# EAGLE design oresat-c3-prototype (EAGLE 9.5.2)

## Sheet 1 of 4: Connectors
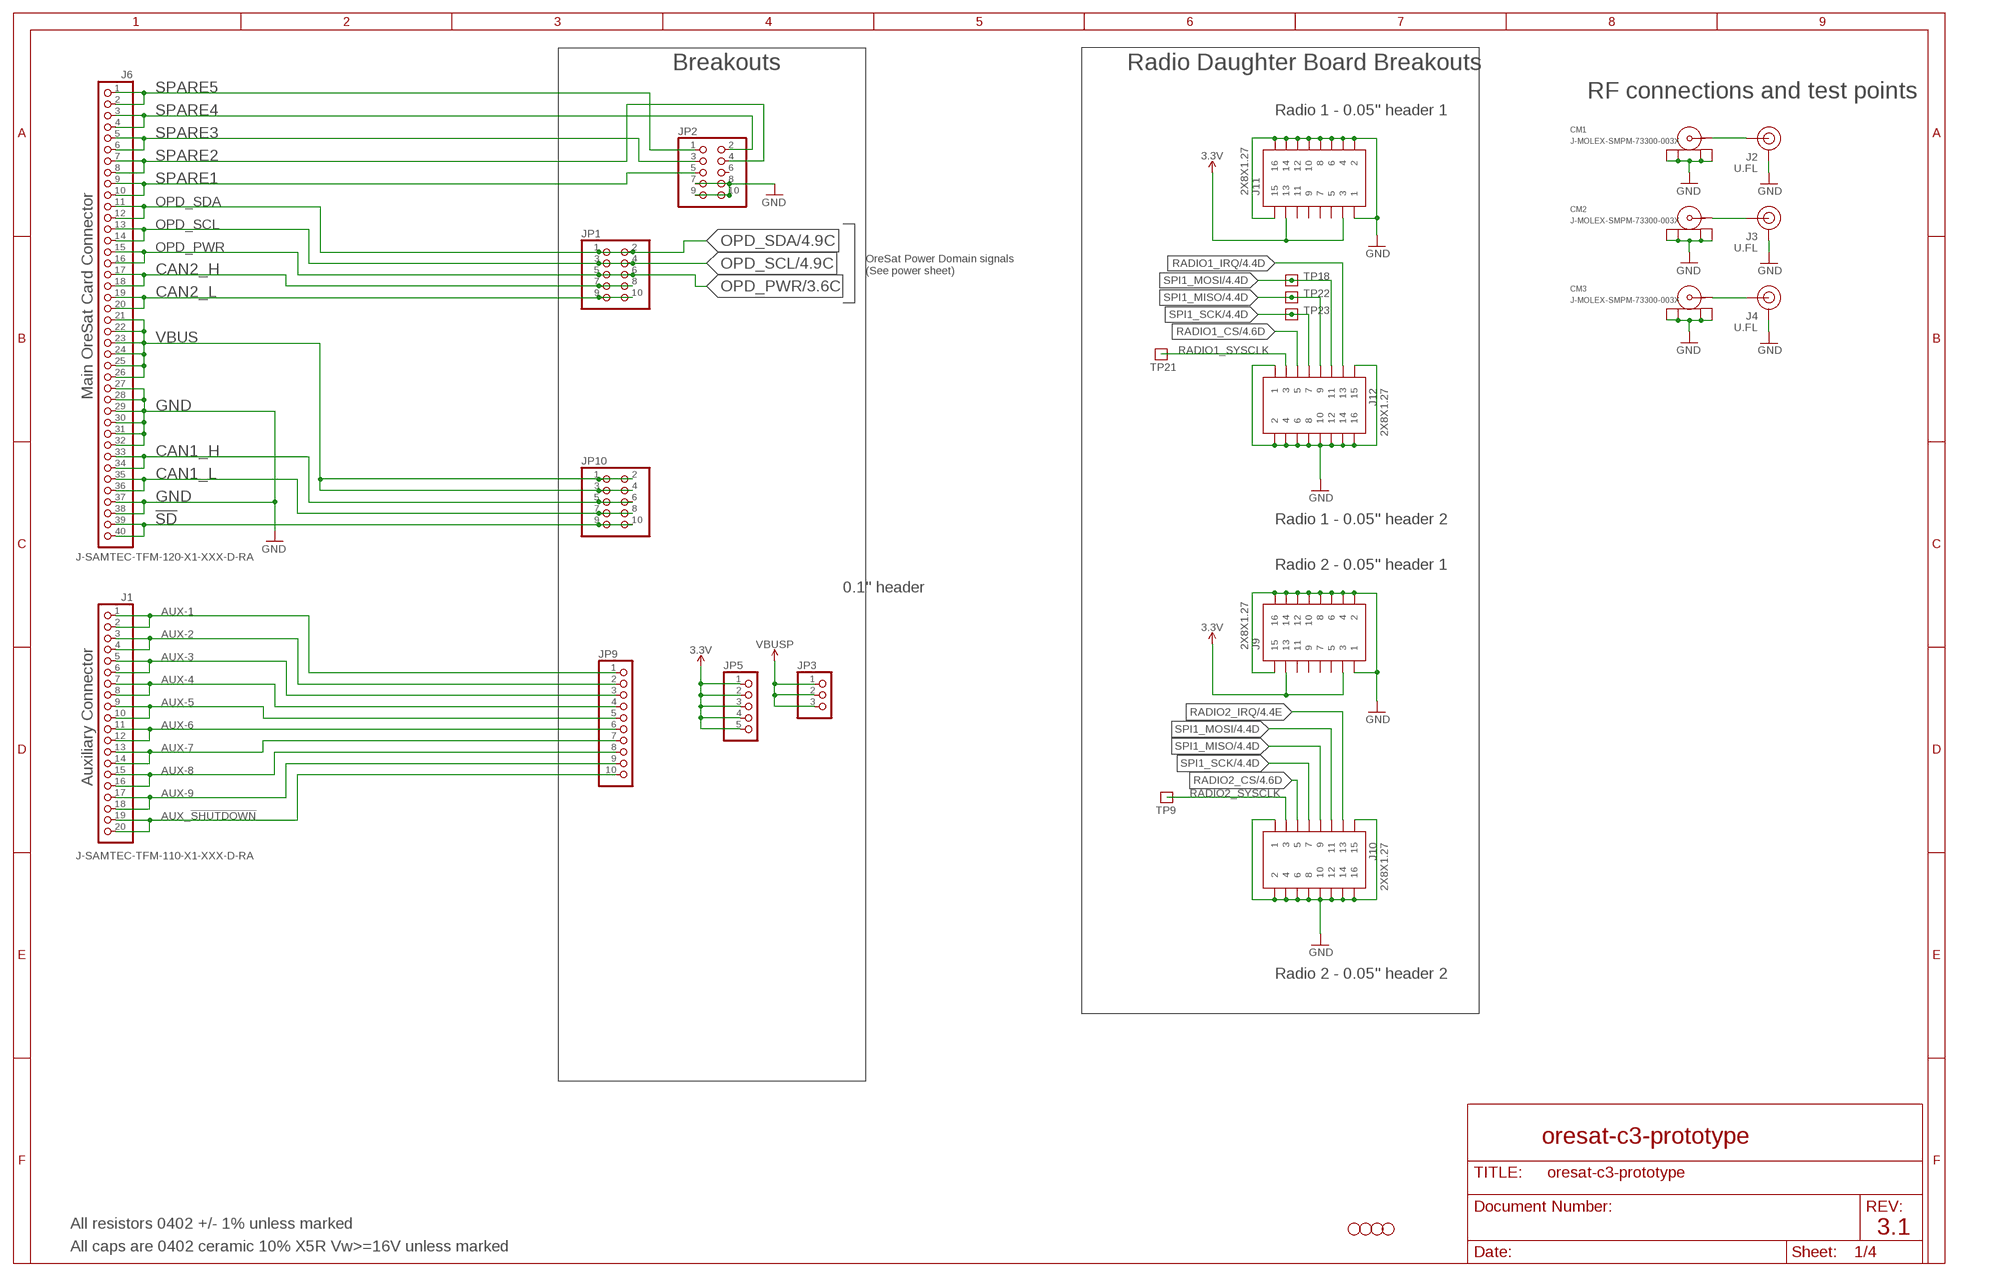
[diagram p0: schematic, sheet 1]

### Parts
CM1  J-MOLEX-SMPM-73300-003X  [J-MOLEX-SMPM-073300-003X]
CM2  J-MOLEX-SMPM-73300-003X  [J-MOLEX-SMPM-073300-003X]
CM3  J-MOLEX-SMPM-73300-003X  [J-MOLEX-SMPM-073300-003X]
H1  STAND-OFFTIGHT  [STAND-OFF-TIGHT]
H2  STAND-OFFTIGHT  [STAND-OFF-TIGHT]
H3  STAND-OFFTIGHT  [STAND-OFF-TIGHT]
H4  STAND-OFFTIGHT  [STAND-OFF-TIGHT]
J1  J-SAMTEC-TFM-110-X1-XXX-D-RA  [J-SAMTEC-TFM-110-X1-XXX-D-RA]
J2  U.FL  U.FL2PIN  [U.FL]
J3  U.FL  U.FL2PIN  [U.FL]
J4  U.FL  U.FL2PIN  [U.FL]
J6  J-SAMTEC-TFM-120-X1-XXX-D-RA  [J-SAMTEC-TFM-120-X1-XXX-D-RA]
J9  2X8X1.27  [2X8X1.27]
J10  2X8X1.27  [2X8X1.27]
J11  2X8X1.27  [2X8X1.27]
J12  2X8X1.27  [2X8X1.27]
JP1  PINHD-2X5  [2X05]
JP2  PINHD-2X5  [2X05]
JP3  PINHD-1X3  [1X03]
JP5  PINHD-1X5  [1X05]
JP9  PINHD-1X10  [1X10]
JP10  PINHD-2X5  [2X05]
TP9  TEST-POINT  [2MM-TEST-POINT]
TP18  TEST-POINT  [2MM-TEST-POINT]
TP21  TEST-POINT  [2MM-TEST-POINT]
TP22  TEST-POINT  [2MM-TEST-POINT]
TP23  TEST-POINT  [2MM-TEST-POINT]

### Nets
3.3V: J9.3 J9.13 J11.3 J11.13 JP5.1 JP5.2 JP5.3 JP5.4 JP5.5 ; also sheet 2,3,4
!SD: J6.39 J6.40 JP10.9 JP10.10 ; also sheet 4
AUX-1: J1.1 J1.2 JP9.1
AUX-2: J1.3 J1.4 JP9.2
AUX-3: J1.5 J1.6 JP9.3
AUX-4: J1.7 J1.8 JP9.4
AUX-5: J1.9 J1.10 JP9.5
AUX-6: J1.11 J1.12 JP9.6
AUX-7: J1.13 J1.14 JP9.7
AUX-8: J1.15 J1.16 JP9.8
AUX-9: J1.17 J1.18 JP9.9
AUX_!SHUTDOWN: J1.19 J1.20 JP9.10
CAN1_H: J6.33 J6.34 JP10.5 JP10.6 ; also sheet 4
CAN1_L: J6.35 J6.36 JP10.7 JP10.8 ; also sheet 4
CAN2_H: J6.17 J6.18 JP1.7 JP1.8 ; also sheet 4
CAN2_L: J6.19 J6.20 JP1.9 JP1.10 ; also sheet 4
GND: CM1.P$1(SHIELD3) CM1.P$2(SHIELD2) CM1.P$3(SHIELD1) CM1.P$4(SHIELD) CM2.P$1(SHIELD3) CM2.P$2(SHIELD2) CM2.P$3(SHIELD1) CM2.P$4(SHIELD) CM3.P$1(SHIELD3) CM3.P$2(SHIELD2) CM3.P$3(SHIELD1) CM3.P$4(SHIELD) J2.1(GND) J2.2(GND) J3.1(GND) J3.2(GND) J4.1(GND) J4.2(GND) J6.27 J6.28 J6.29 J6.30 J6.31 J6.32 J6.37 J6.38 J9.1 J9.2 J9.4 J9.6 J9.8 J9.10 J9.12 J9.14 J9.15 J9.16 J10.1 J10.2 J10.4 J10.6 J10.8 J10.10 J10.12 J10.14 J10.15 J10.16 J11.1 J11.2 J11.4 J11.6 J11.8 J11.10 J11.12 J11.14 J11.15 J11.16 J12.1 J12.2 J12.4 J12.6 J12.8 J12.10 J12.12 J12.14 J12.15 J12.16 JP2.7 JP2.8 JP2.9 JP2.10 ; also sheet 2,3,4
N$300: CM3.RF(CENTER) J4.FEED(SIGNAL)
OPD_PWR: J6.15 J6.16 JP1.5 JP1.6 ; also sheet 3,4
OPD_SCL: J6.13 J6.14 JP1.3 JP1.4 ; also sheet 4
OPD_SDA: J6.11 J6.12 JP1.1 JP1.2 ; also sheet 4
RADIO1_CS: J12.5 ; also sheet 4
RADIO1_IRQ: J12.13 ; also sheet 4
RADIO1_SYSCLK: J12.3 TP21.1
RADIO2_CS: J10.5 ; also sheet 4
RADIO2_IRQ: J10.13 ; also sheet 4
RADIO2_SYSCLK: J10.3 TP9.1
RF1: CM1.RF(CENTER) J2.FEED(SIGNAL)
RF2: CM2.RF(CENTER) J3.FEED(SIGNAL)
SPARE1: J6.9 J6.10 JP2.5
SPARE2: J6.7 J6.8 JP2.4
SPARE3: J6.5 J6.6 JP2.3
SPARE4: J6.3 J6.4 JP2.2
SPARE5: J6.1 J6.2 JP2.1
SPI1_MISO: J10.9 J12.9 TP22.1 ; also sheet 4
SPI1_MOSI: J10.11 J12.11 TP18.1 ; also sheet 4
SPI1_SCK: J10.7 J12.7 TP23.1 ; also sheet 4
VBUS: J6.21 J6.22 J6.23 J6.24 J6.25 J6.26 JP10.1 JP10.2 JP10.3 JP10.4 ; also sheet 2
VBUSP: JP3.1 JP3.2 JP3.3 ; also sheet 2,4
Unconnected: J9.5 J9.7 J9.9 J9.11 J11.5 J11.7 J11.9 J11.11 JP2.6

### Notes on the sheet
- Breakouts | Radio Daughter Board Breakouts
- RF connections and test points
- Radio 1 - 0.05" header 1
- OreSat Power Domain signals
  (See power sheet)
- Main OreSat Card Connector
- Radio 1 - 0.05" header 2
- Radio 2 - 0.05" header 1
- 0.1" header
- Auxiliary Connector
- Radio 2 - 0.05" header 2
- oresat-c3-prototype
- All resistors 0402 +/- 1% unless marked
- 3.1
- All caps are 0402 ceramic 10% X5R Vw>=16V unless marked

## Sheet 2 of 4: Power
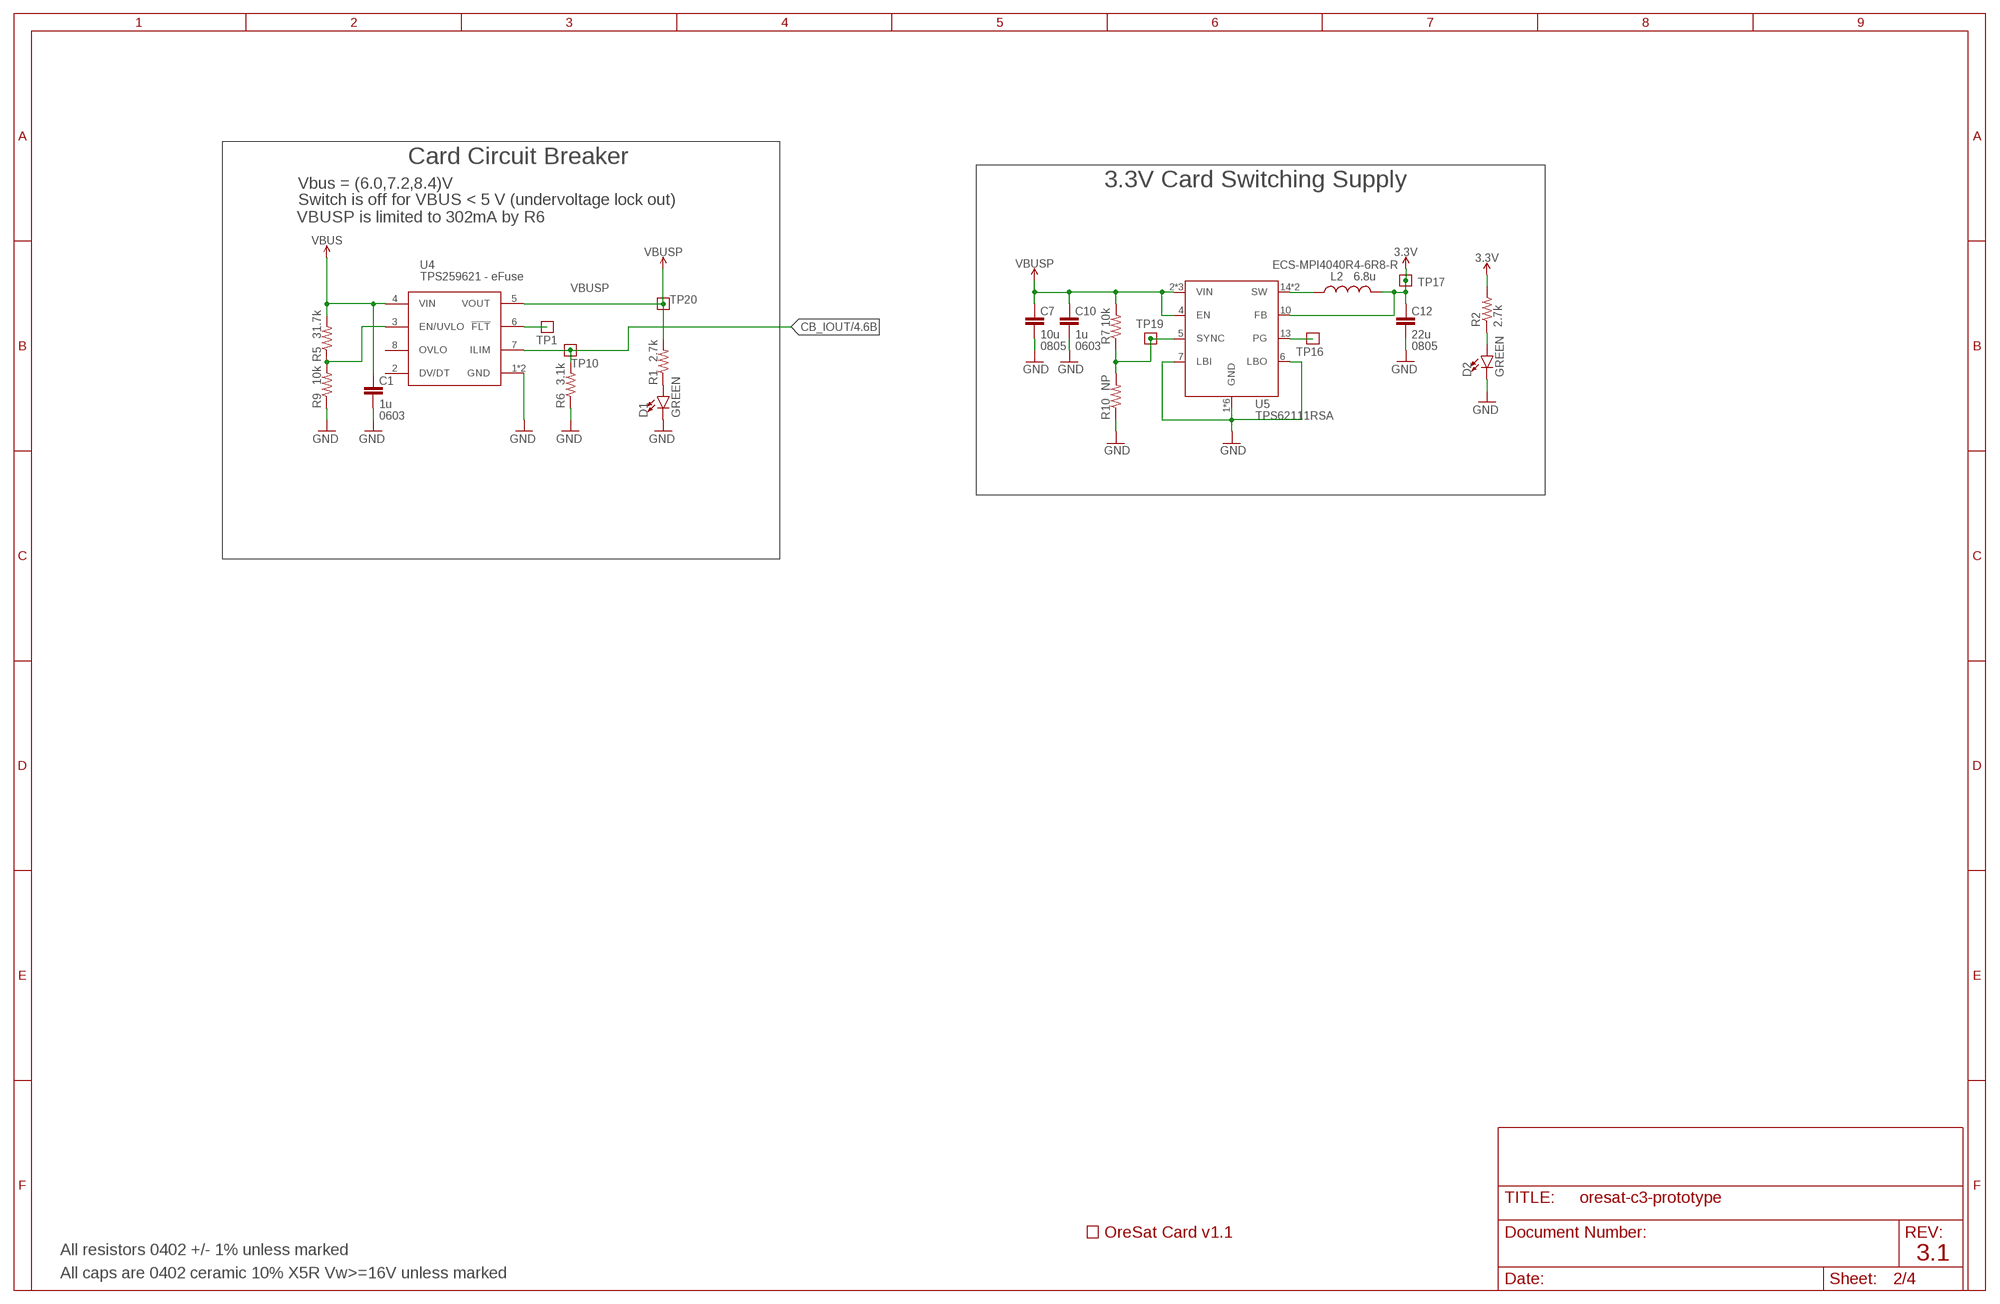
[diagram p1: schematic, sheet 2]

### Parts
C1  1u  C-EU0603-B-NOSILK  [.0603-B-NOSILK]
C7  10u  C-EU0805-B-NOSILK  [.0805-B-NOSILK]
C10  1u  C-EU0603-B-NOSILK  [.0603-B-NOSILK]
C12  22u  C-EU0805-B-NOSILK  [.0805-B-NOSILK]
D1  GREEN  LED-GREEN0603  [LED-0603]
D2  GREEN  LED-GREEN0603  [LED-0603]
L2  6.8u  L-ECS-MPI4040  [ECS-MPI4040]
R1  2.7k  R-US_0402-B-NOSILK  [.0402-B-NOSILK]
R2  2.7k  R-US_0402-B-NOSILK  [.0402-B-NOSILK]
R5  31.7k  R-US_0402-B-NOSILK  [.0402-B-NOSILK]
R6  3.1k  R-US_0402-B-NOSILK  [.0402-B-NOSILK]
R7  10k  R-US_0402-B-NOSILK  [.0402-B-NOSILK]
R9  10k  R-US_0402-B-NOSILK  [.0402-B-NOSILK]
R10  NP  R-US_0402-B-NOSILK  [.0402-B-NOSILK]
TP1  TEST-POINT  [2MM-TEST-POINT]
TP10  TEST-POINT  [2MM-TEST-POINT]
TP16  TEST-POINT  [2MM-TEST-POINT]
TP17  TEST-POINT  [2MM-TEST-POINT]
TP19  TEST-POINT  [2MM-TEST-POINT]
TP20  TEST-POINT  [2MM-TEST-POINT]
U4  TPS259621 - eFuse  TPS2596XX  [SO-POWERPAD-8]
U5  TPS62111RSA  TPS6211X  [S-PVQFN-16]
U$1  ORESAT-CARD-V1.1-3XRF  [ORESAT-CARD-V1.1-3XRF]

### Nets
3.3V: C12.1 L2.2 R2.2 TP17.1 U5.10(FB) ; also sheet 1,3,4
!CB_FLT: TP1.1 U4.6(!FLT)
CB_IOUT: R6.2 TP10.1 U4.7(ILIM) ; also sheet 4
EN/UVLO: R5.1 R9.2 U4.3(EN/UVLO)
GND: C1.2 C7.2 C10.2 C12.2 D1.C D2.C R6.1 R9.1 R10.1 U4.1(GND) U4.THERMAL(GND) U5.1(GND) U5.6(LBO) U5.7(LBI) U5.9(GND) U5.11(GND) U5.12(GND) U5.16(GND) U5.PAD(GND) ; also sheet 1,3,4
N$270: D1.A R1.1
N$271: D2.A R2.1
TPS62111-PG: TP16.1 U5.13(PG)
TPS62111-SYNC: R7.1 R10.2 TP19.1 U5.5(SYNC)
TPS62111_SW: L2.1 U5.14(SW) U5.15(SW)
VBUS: C1.1 R5.2 U4.4(VIN) ; also sheet 1
VBUSP: C7.1 C10.1 R1.2 R7.2 TP20.1 U4.5(VOUT) U5.2(VIN) U5.3(VIN) U5.4(EN) U5.8(VIN) ; also sheet 1,4
Unconnected: U4.2(DV/DT) U4.8(OVLO)

### Notes on the sheet
- Card Circuit Breaker
- Vbus = (6.0,7.2,8.4)V | 3.3V Card Switching Supply
- Switch is off for VBUS < 5 V (undervoltage lock out)
- VBUSP is limited to 302mA by R6
- ECS-MPI4040R4-6R8-R
- 0805 | 0603 | 0805
- 0603
- All resistors 0402 +/- 1% unless marked
- 3.1
- All caps are 0402 ceramic 10% X5R Vw>=16V unless marked

## Sheet 3 of 4: OPD
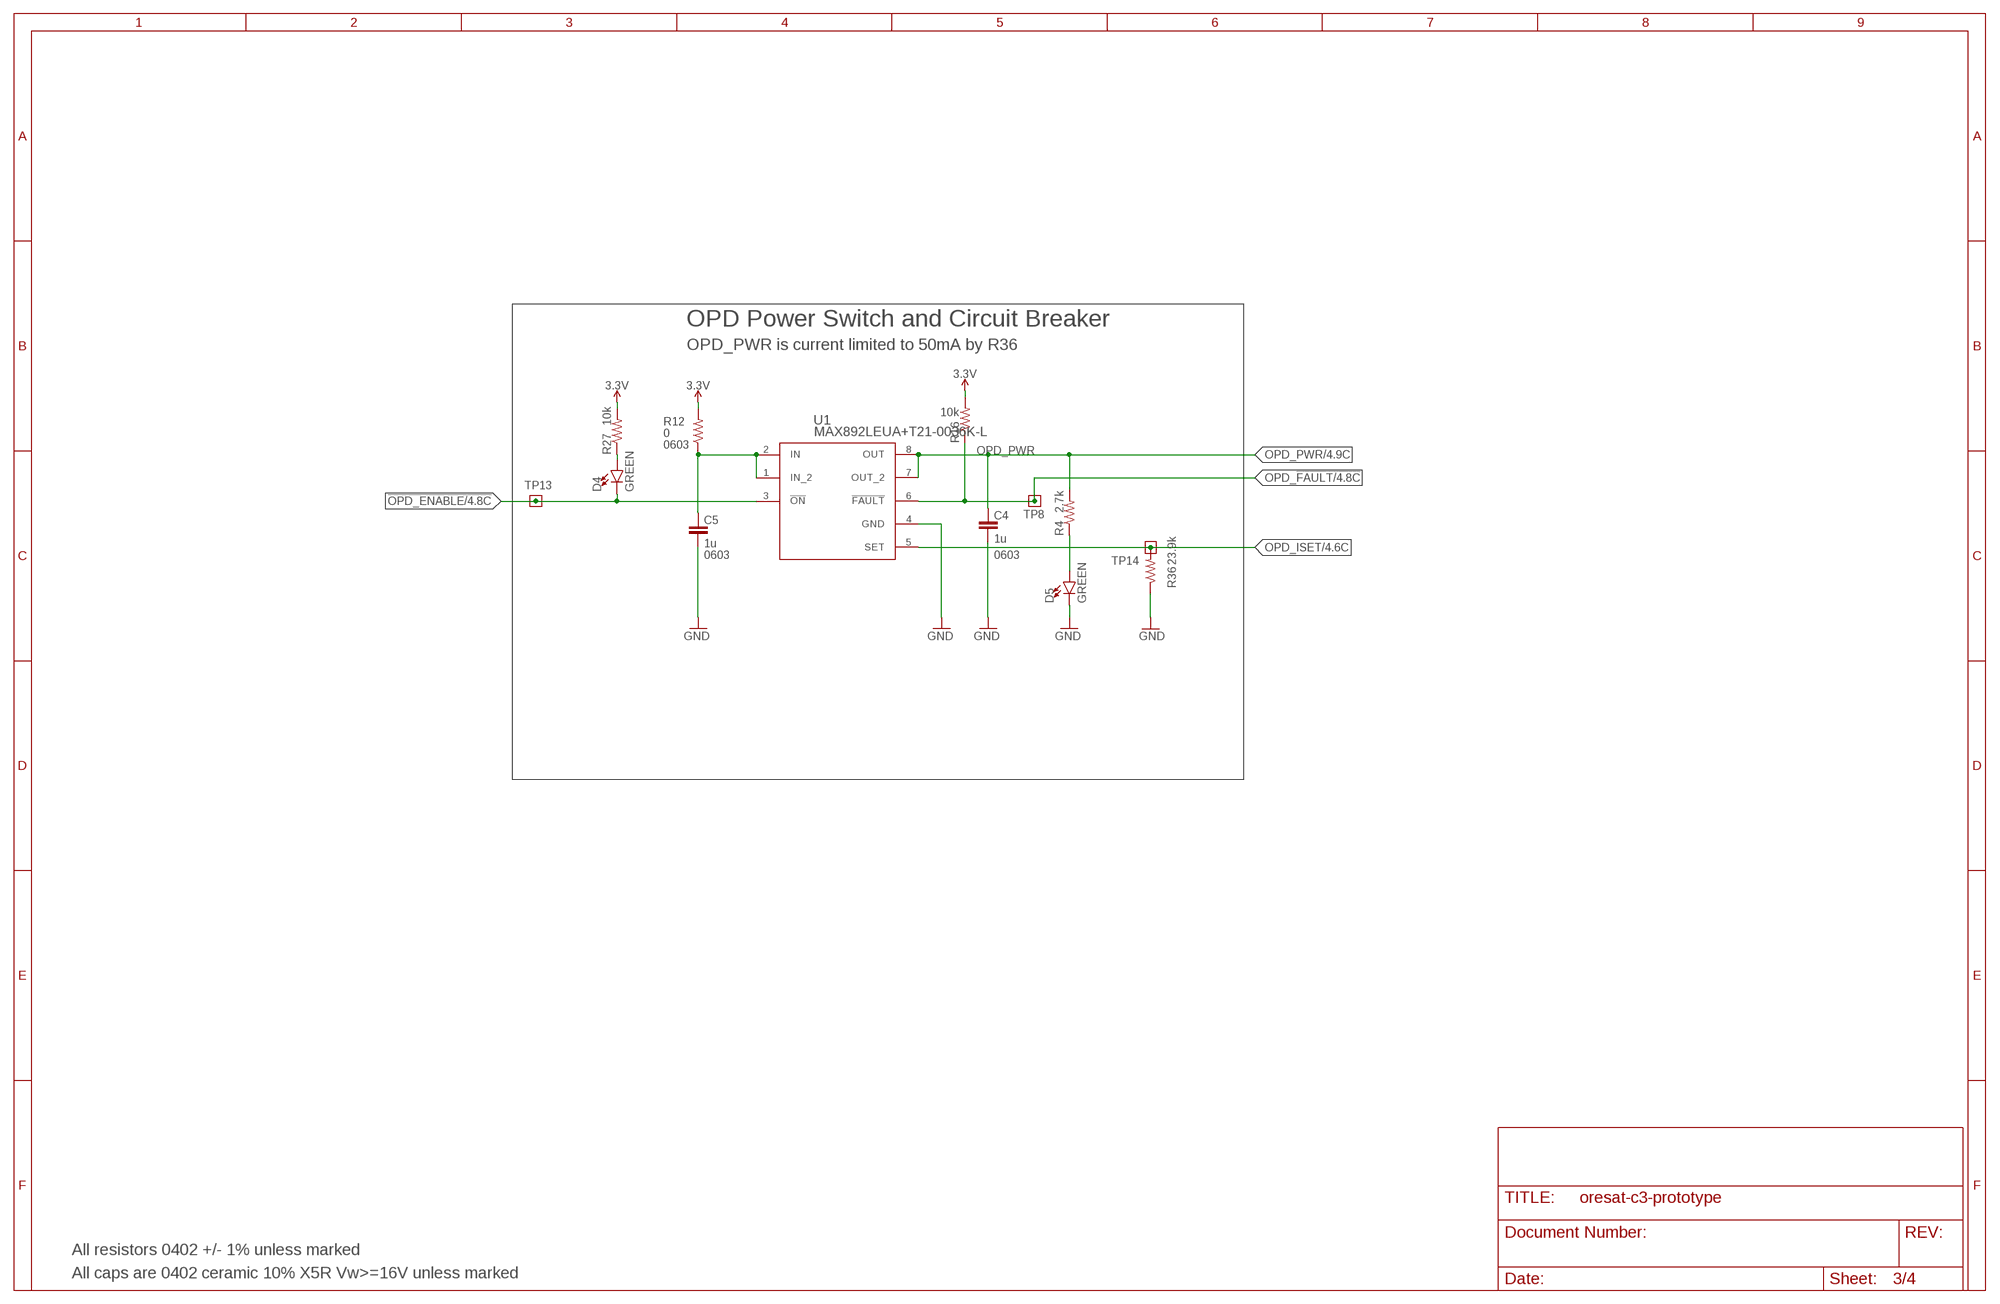
[diagram p2: schematic, sheet 3]

### Parts
C4  1u  C-EU0603-B-NOSILK  [.0603-B-NOSILK]
C5  1u  C-EU0603-B-NOSILK  [.0603-B-NOSILK]
D4  GREEN  LED-GREEN0603  [LED-0603]
D5  GREEN  LED-GREEN0603  [LED-0603]
R4  2.7k  R-US_0402-B-NOSILK  [.0402-B-NOSILK]
R12  0  R-US_0603-B-NOSILK  [.0603-B-NOSILK]
R16  10k  R-US_0402-B-NOSILK  [.0402-B-NOSILK]
R27  10k  R-US_0402-B-NOSILK  [.0402-B-NOSILK]
R36  23.9k  R-US_0402-B-NOSILK  [.0402-B-NOSILK]
TP8  TEST-POINT  [2MM-TEST-POINT]
TP13  TEST-POINT  [2MM-TEST-POINT]
TP14  TEST-POINT  [2MM-TEST-POINT]
U1  MAX892LEUA+T21-0036K-L  [21-0036K-L]

### Nets
3.3V: R12.2 R16.2 R27.2 ; also sheet 1,2,4
!OPD_ENABLE: D4.C TP13.1 U1.3(!ON) ; also sheet 4
GND: C4.2 C5.2 D5.C R36.1 U1.4(GND) ; also sheet 1,2,4
N$5: D4.A R27.1
N$400: D5.A R4.1
OPD-3.3V: C5.1 R12.1 U1.1(IN_2) U1.2(IN)
OPD_!FAULT: R16.1 TP8.1 U1.6(!FAULT) ; also sheet 4
OPD_ISET: R36.2 TP14.1 U1.5(SET) ; also sheet 4
OPD_PWR: C4.1 R4.2 U1.7(OUT_2) U1.8(OUT) ; also sheet 1,4

### Notes on the sheet
- OPD Power Switch and Circuit Breaker
- OPD_PWR is current limited to 50mA by R36
- 0603
- 0603 | 0603
- All resistors 0402 +/- 1% unless marked
- All caps are 0402 ceramic 10% X5R Vw>=16V unless marked

## Sheet 4 of 4: Microcontroller
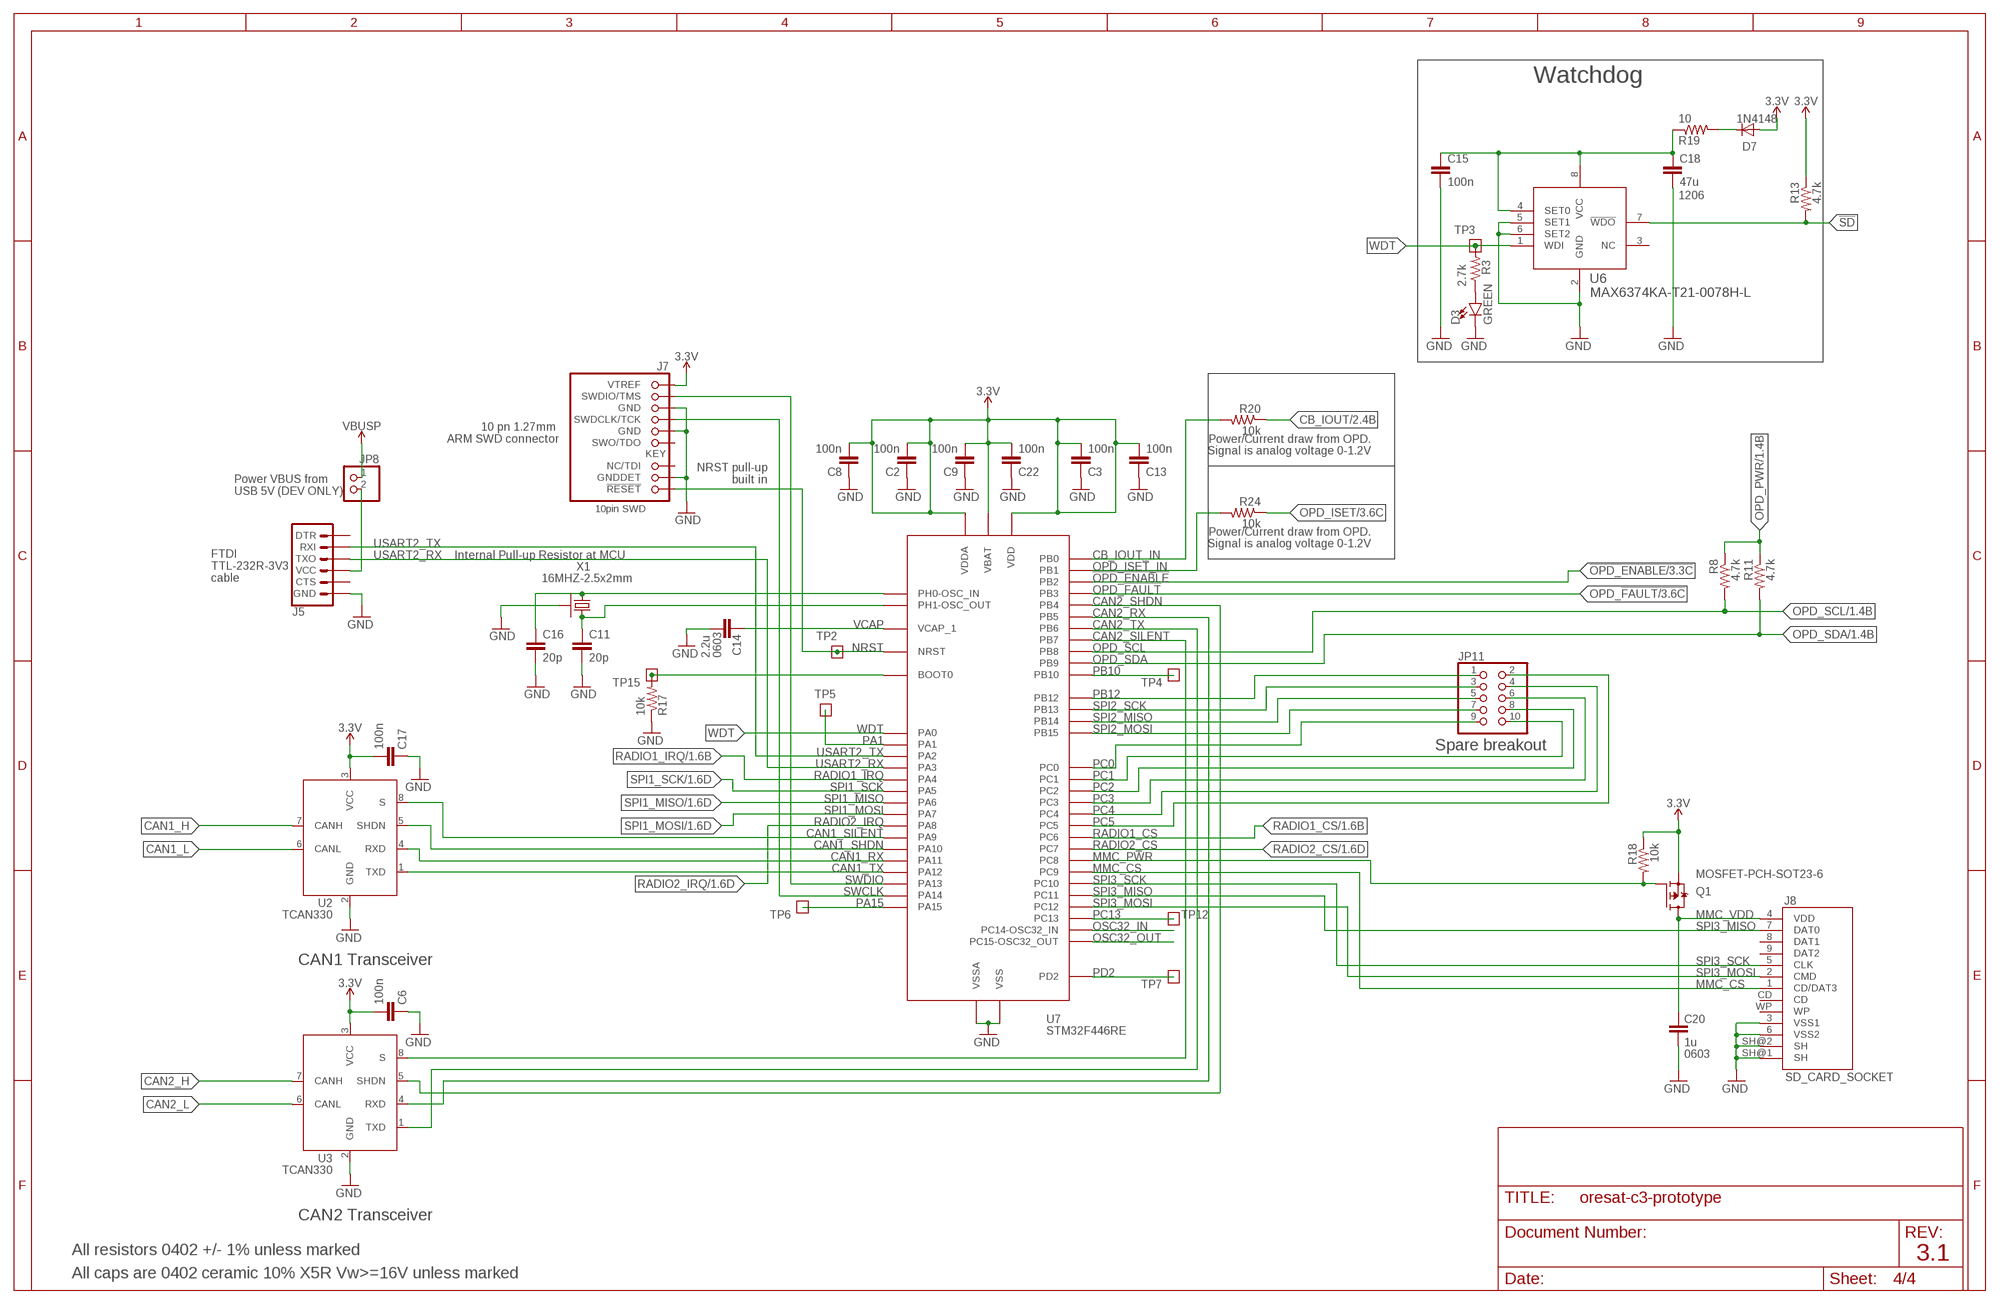
[diagram p3: schematic, sheet 4]

### Parts
C2  100n  C-EU0402-B-NOSILK  [.0402-B-NOSILK]
C3  100n  C-EU0402-B-NOSILK  [.0402-B-NOSILK]
C6  100n  C-EU0402-B-NOSILK  [.0402-B-NOSILK]
C8  100n  C-EU0402-B-NOSILK  [.0402-B-NOSILK]
C9  100n  C-EU0402-B-NOSILK  [.0402-B-NOSILK]
C11  20p  C-EU0402-B-NOSILK  [.0402-B-NOSILK]
C13  100n  C-EU0402-B-NOSILK  [.0402-B-NOSILK]
C14  2.2u  C-EU0603-B-NOSILK  [.0603-B-NOSILK]
C15  100n  C-EU0402-B-NOSILK  [.0402-B-NOSILK]
C16  20p  C-EU0402-B-NOSILK  [.0402-B-NOSILK]
C17  100n  C-EU0402-B-NOSILK  [.0402-B-NOSILK]
C18  47u  C-EU1206-B  [1206-B]
C20  1u  C-EU0603-B-NOSILK  [.0603-B-NOSILK]
C22  100n  C-EU0402-B-NOSILK  [.0402-B-NOSILK]
D3  GREEN  LED-GREEN0603  [LED-0603]
D7  1N4148  DIODESOD  [SOD-323]
J5  6_PIN_SERIAL_TARGETSILK  [6_PIN_SERIAL_TARGET_SIDE_W_SILK]
J7  FTSH-105-XX-X-DV-K  [CON10_2X5_DUK_FTSH]
J8  SD_CARD_SOCKET  [SD]
JP8  PINHD-1X2  [1X02]
JP11  PINHD-2X5  [2X05]
Q1  MOSFET-PCH-SOT23-6  [SOT23-6]
R3  2.7k  R-US_0402-B-NOSILK  [.0402-B-NOSILK]
R8  4.7k  R-US_0402-B-NOSILK  [.0402-B-NOSILK]
R11  4.7k  R-US_0402-B-NOSILK  [.0402-B-NOSILK]
R13  4.7k  R-US_0402-B-NOSILK  [.0402-B-NOSILK]
R17  10k  R-US_0402-B-NOSILK  [.0402-B-NOSILK]
R18  10k  R-US_0402-B-NOSILK  [.0402-B-NOSILK]
R19  10  R-US_0402-B-NOSILK  [.0402-B-NOSILK]
R20  10k  R-US_0402-B-NOSILK  [.0402-B-NOSILK]
R24  10k  R-US_0402-B-NOSILK  [.0402-B-NOSILK]
TP2  TEST-POINT  [2MM-TEST-POINT]
TP3  TEST-POINT  [2MM-TEST-POINT]
TP4  TEST-POINT  [2MM-TEST-POINT]
TP5  TEST-POINT  [2MM-TEST-POINT]
TP6  TEST-POINT  [2MM-TEST-POINT]
TP7  TEST-POINT  [2MM-TEST-POINT]
TP12  TEST-POINT  [2MM-TEST-POINT]
TP15  TEST-POINT  [2MM-TEST-POINT]
U2  TCAN330  [SOT23-8_TI-DCN]
U3  TCAN330  [SOT23-8_TI-DCN]
U6  MAX6374KA-T21-0078H-L  [21-0078H-L]
U7  STM32F446RE  [QFP-10X10-64]
X1  16MHZ-2.5x2mm  CRYSTAL-WITH-GND  [CRYSTAL_2.5X2]

### Nets
3.3V: C2.2 C3.2 C6.2 C8.2 C9.2 C13.2 C17.2 C22.2 D7.2(A) J7.1(VTREF) Q1.4(S) R13.1 R18.1 U2.3(VCC) U3.3(VCC) U7.1(VBAT) U7.13(VDDA) U7.19(VDD) U7.32(VDD) U7.48(VDD) U7.64(VDD) ; also sheet 1,2,3
!OPD_ENABLE: U7.28(PB2) ; also sheet 3
!SD: R13.2 U6.7(!WDO) ; also sheet 1
BOOT0: R17.2 TP15.1 U7.60(BOOT0)
CAN1_H: U2.7(CANH) ; also sheet 1
CAN1_L: U2.6(CANL) ; also sheet 1
CAN1_RX: U2.4(RXD) U7.44(PA11)
CAN1_SHDN: U2.5(SHDN) U7.43(PA10)
CAN1_SILENT: U2.8(S) U7.42(PA9)
CAN1_TX: U2.1(TXD) U7.45(PA12)
CAN2_H: U3.7(CANH) ; also sheet 1
CAN2_L: U3.6(CANL) ; also sheet 1
CAN2_RX: U3.4(RXD) U7.57(PB5)
CAN2_SHDN: U3.5(SHDN) U7.56(PB4)
CAN2_SILENT: U3.8(S) U7.59(PB7)
CAN2_TX: U3.1(TXD) U7.58(PB6)
CB_IOUT: R20.1 ; also sheet 2
CB_IOUT_IN: R20.2 U7.26(PB0)
CRYSTALIN: C16.1 U7.5(PH0-OSC_IN) X1.1
CRYSTALOUT: C11.1 U7.6(PH1-OSC_OUT) X1.3
GND: C2.1 C3.1 C6.1 C8.1 C9.1 C11.2 C13.1 C14.2 C15.2 C16.2 C17.1 C18.2 C20.2 C22.1 D3.C J5.P$6(GND) J7.3(GND) J7.5(GND) J7.9(GNDDET) J8.3(VSS1) J8.6(VSS2) J8.SH@1(SH) J8.SH@2(SH) R17.1 U2.2(GND) U3.2(GND) U6.2(GND) U6.5(SET1) U6.6(SET2) U7.12(VSSA) U7.18(VSS) U7.31(VSS) U7.47(VSS) U7.63(VSS) X1.2(SHIELD) X1.4(SHIELD) ; also sheet 1,2,3
MMC_CS: J8.1(CD/DAT3) U7.40(PC9)
MMC_PWR: Q1.3(G) R18.2 U7.39(PC8)
MMC_VDD: C20.1 J8.4(VDD) Q1.1(D) Q1.2(D) Q1.5(D) Q1.6(D)
N$1: D3.A R3.1
N$3: D7.1(C) R19.2
N$406: J5.P$4(VCC) JP8.2
NRST: J7.10(!RESET) TP2.1 U7.7(NRST)
OPD_!FAULT: U7.55(PB3) ; also sheet 3
OPD_ISET: R24.1 ; also sheet 3
OPD_ISET_IN: R24.2 U7.27(PB1)
OPD_PWR: R8.1 R11.1 ; also sheet 1,3
OPD_SCL: R8.2 U7.61(PB8) ; also sheet 1
OPD_SDA: R11.2 U7.62(PB9) ; also sheet 1
OSC32_IN: U7.3(PC14-OSC32_IN)
OSC32_OUT: U7.4(PC15-OSC32_OUT)
PA1: TP5.1 U7.15(PA1)
PA15: TP6.1 U7.50(PA15)
PB10: TP4.1 U7.29(PB10)
PB12: JP11.1 U7.33(PB12)
PC0: JP11.9 U7.8(PC0)
PC1: JP11.10 U7.9(PC1)
PC2: JP11.8 U7.10(PC2)
PC3: JP11.6 U7.11(PC3)
PC4: JP11.4 U7.24(PC4)
PC5: JP11.2 U7.25(PC5)
PC13: TP12.1 U7.2(PC13)
PD2: TP7.1 U7.54(PD2)
RADIO1_CS: U7.37(PC6) ; also sheet 1
RADIO1_IRQ: U7.20(PA4) ; also sheet 1
RADIO2_CS: U7.38(PC7) ; also sheet 1
RADIO2_IRQ: U7.41(PA8) ; also sheet 1
SPI1_MISO: U7.22(PA6) ; also sheet 1
SPI1_MOSI: U7.23(PA7) ; also sheet 1
SPI1_SCK: U7.21(PA5) ; also sheet 1
SPI2_MISO: JP11.5 U7.35(PB14)
SPI2_MOSI: JP11.7 U7.36(PB15)
SPI2_SCK: JP11.3 U7.34(PB13)
SPI3_MISO: J8.7(DAT0) U7.52(PC11)
SPI3_MOSI: J8.2(CMD) U7.53(PC12)
SPI3_SCK: J8.5(CLK) U7.51(PC10)
SWCLK: J7.4(SWDCLK/TCK) U7.49(PA14)
SWDIO: J7.2(SWDIO/TMS) U7.46(PA13)
USART2_RX: J5.P$2(TXO) U7.17(PA3)
USART2_TX: J5.P$3(RXI) U7.16(PA2)
VBUSP: JP8.1 ; also sheet 1,2
VCAP: C14.1 U7.30(VCAP_1)
WDT: R3.2 TP3.1 U6.1(WDI) U7.14(PA0)
WDT-PWR: C15.1 C18.1 R19.1 U6.4(SET0) U6.8(VCC)
Unconnected: J5.P$1(DTR) J5.P$5(CTS) J7.6(SWO/TDO) J7.8(NC/TDI) J8.8(DAT1) J8.9(DAT2) J8.CD J8.WP U6.3(NC)

### Notes on the sheet
- Watchdog
- 1206
- 10 pn 1.27mm 
  ARM SWD connector
- Power/Current draw from OPD.
- Signal is analog voltage 0-1.2V
- NRST pull-up
  built in
- Power VBUS from
  USB 5V (DEV ONLY)
- Power/Current draw from OPD.
- Signal is analog voltage 0-1.2V
- Internal Pull-up Resistor at MCU
- FTDI 
  TTL-232R-3V3
  cable
- 0603
- Spare breakout
- CAN1 Transceiver
- 0603
- CAN2 Transceiver
- All resistors 0402 +/- 1% unless marked
- 3.1
- All caps are 0402 ceramic 10% X5R Vw>=16V unless marked

## Library data of the parts
C1-C6 C8-C10 C13 C14 C17 C20 C22 = oresat-rcl:C-EU: CAPACITOR, European symbol; DIS: Digi-Key; DPN: 1276-1001-1-ND; MFR: Samsung; MPN: CL05B104KO5NNNC
C7 C12 = oresat-rcl:C-EU: CAPACITOR, European symbol
C11 = rcl_custom:C-EU: CAPACITOR, European symbol; DIS: Digi-Key; DPN: 1276-6601-1-ND; MFR: Samsung; MPN: CL05C200JB51PNC
C15 C16 C18 = oresat-rcl:C-EU: CAPACITOR, European symbol; DIS: Digi-Key; DPN: 1276-6601-1-ND; MFR: Samsung; MPN: CL05C200JB51PNC
CM1-CM3 = J-Molex-SMPM-73300-003X:J-MOLEX-SMPM-73300-003X; MFR: Molex; MPN: 73300-0020
D1 D2 D4 D5 = SparkFun-LED:LED-GREEN: Green SMD LED Used in manufacturing of various products at SparkFun Packages: 0603 - SMD 0603 package [Product Link] <http://www.futureelectronics.com/en/technologies/semiconductors/optoelectronics/leds/Pages/9894312-LTST-C190GKT.aspx?CrossPart=HSMG-C190&IM=0> LilyPad 1206 - SMD1206 LilyPad package [Product Link] <http://www.futureelectronics.com/en/Technologies/Product.aspx?ProductID=IN150NGHARVATEKCORPORATION2049943&IM=0> 1206 - SMD1206 package [Product Link] <http://www.futureelectronics.com/en/technologies/semiconductors/optoelectronics/leds/Pages/8315665-LTST-C150KGKT.aspx?IM=0> 1206 Bottom Mount -SMD 1206 Bottom Mount [Product Link] <http://www.digikey.com/product-detail/en/lite-on-inc/LTST-C230KGKT/160-1456-1-ND/386854> SparkFun Products: Pro Mini 328 -5V <https://www.sparkfun.com/products/821> RedBoard <https://www.sparkfun.com/products/12757> MP3 Trigger <https://www.sparkfun.com/products/13720> Makey Makey <https://www.sparkfun.com/products/11076>
D3 = SparkFun-LED:LED-GREEN: Green SMD LED Used in manufacturing of various products at SparkFun Packages: 0603 - SMD 0603 package [Product Link] <http://www.futureelectronics.com/en/technologies/semiconductors/optoelectronics/leds/Pages/9894312-LTST-C190GKT.aspx?CrossPart=HSMG-C190&IM=0> LilyPad 1206 - SMD1206 LilyPad package [Product Link] <http://www.futureelectronics.com/en/Technologies/Product.aspx?ProductID=IN150NGHARVATEKCORPORATION2049943&IM=0> 1206 - SMD1206 package [Product Link] <http://www.futureelectronics.com/en/technologies/semiconductors/optoelectronics/leds/Pages/8315665-LTST-C150KGKT.aspx?IM=0> 1206 Bottom Mount -SMD 1206 Bottom Mount [Product Link] <http://www.digikey.com/product-detail/en/lite-on-inc/LTST-C230KGKT/160-1456-1-ND/386854> SparkFun Products: Pro Mini 328 -5V <https://www.sparkfun.com/products/821> RedBoard <https://www.sparkfun.com/products/12757> MP3 Trigger <https://www.sparkfun.com/products/13720> Makey Makey <https://www.sparkfun.com/products/11076>; PROD_ID: DIO-00821
D7 = SparkFun:DIODE: Diode These are standard reverse protection diodes and small signal diodes. SMA package can handle up to about 1A. SOD-323 can handle about 200mA. What the SOD-323 package when ordering, there are some mfgs out there that are 5-pin packages.
H1-H4 = SparkFun-Hardware:STAND-OFF: Stand Off Drill holes for mechanically mounting via screws, standoffs, etc. Note: Use the keepout ring to avoid running the screw head into surrounding components. Variant Overviews STAND-OFF - Mechanical footprint for a #4 phillips button head screw. STAND-OFF-TIGHT - Mechanical footprint for a #4 phillips button head screw, Example SparkFun Products Screw - Phillips Head (1/4", 4-40, 10 pack) <https://www.sparkfun.com/products/10453> (PRT-10453) Screw - Phillips Head (1/2", 4-40, 10 pack) <https://www.sparkfun.com/products/10452> (PRT-10452) Screw - Phillips Head (3/4", 4-40, 10 pack) <https://www.sparkfun.com/products/10451> (PRT-10451) Screw - Phillips Head (1", 4-40, 10 pack) <https://www.sparkfun.com/products/10450> (PRT-10450)
J1 = J-Samtec-TFM-110-X1-XXX-D-RA:J-SAMTEC-TFM-110-X1-XXX-D-RA; MFR: Samtec; MPN: TFM-110-01-L-D-RA
J2-J4 = SparkFun-Connectors:U.FL2PIN: SMD Antenna Connector - U.FL 2mm height, 3.0mm x 3.0mm receptacle size. SparkFun Products: SparkFun WiFi Shield - ESP8266 <https://www.sparkfun.com/products/13287> SparkFun ESP8266 Thing <https://www.sparkfun.com/products/13231> SparkFun MiniGen - Pro Mini Signal Generator Shield <https://www.sparkfun.com/products/11420>; PROD_ID: CONN-09193; SF_ID: WRL-09144
J5 = SparkFun-Connectors:6_PIN_SERIAL_TARGET: 6-pin header connection for use with the "FTDI BASIC" pinout - TARGET SIDE. Also known as "Arduino Serial Program Header". It is used to mate with our FTDI Basic serial programmers using the Arduino IDE. Note, this device has "TARGET" in the name. It is intended to be used on a design that contains a target micro-controller that you wish to program. The "sister" device, named "CABLE" is inteneded to be used on a design that usually lives on the end of your USB cable and prvides the converter chip (FTDI232 or FTDI231x) to commnicate serial RX/TX. You can populate with some of these: Break Away Headers - Straight <https://www.sparkfun.com/products/116> (PRT-00116) For reference (or to suit your programming needs) check out these designs: SparkFun FTDI Basic Breakout - 5V <https://www.sparkfun.com/products/9716> (DEV-09716) SparkFun FTDI Basic Breakout - 3.3V <https://www.sparkfun.com/products/9873> (DEV-09873) SparkFun FTDI SmartBasic <https://www.sparkfun.com/products/12935> (DEV-12935) SparkFun Beefy 3 - FTDI Basic Breakout <https://www.sparkfun.com/products/13746> (DEV-13746)
J6 = J-Samtec-TFM-120-X1-XXX-D-RA:J-SAMTEC-TFM-120-X1-XXX-D-RA; MFR: Samtec; MPN: TFM-120-01-L-D-RA
J7 = J-Samtec-FTSH-105-XXX-DV-K-ARM-SWD:FTSH-105-XX-X-DV-K; MFR: Samtec; MPN: FTSH-105-01-F-DV-K
J8 = J-4UCON-SparkfunPN-PRT-12769-SD-MMC-card-socket:SD_CARD_SOCKET: SD Memory Card Connector (standard "large" size) Push-push normal type, CD enable, WP enable. Here is the connector we sell at SparkFun: SD/MMC Socket <https://www.sparkfun.com/products/12769> (PRT-12769) Datasheet <https://cdn.sparkfun.com/datasheets/Prototyping/19608.pdf> It is used on these SparkFun products: SparkFun SD/MMC Card Breakout <https://www.sparkfun.com/products/12941> (BOB-12941) SD Sniffer <https://www.sparkfun.com/products/11468> (TOL-11468); PROD_ID: CONN-11976; SF_ID: PRT-12769
J9-J12 = 2x8x1.27:2X8X1.27
JP1 JP2 JP10 JP11 = pinhead:PINHD-2X5: PIN HEADER
JP3 = pinhead:PINHD-1X3: PIN HEADER
JP5 = pinhead:PINHD-1X5: PIN HEADER
JP8 = pinhead:PINHD-1X2: PIN HEADER
JP9 = pinhead:PINHD-1X10: PIN HEADER
L2 = L-ECS-MPI4040:L-ECS-MPI4040; MFR: ECS; MPN: ECS-MPI4040R4-6R8-R
Q1 = Q-MOSFET-PCH-SOT23-6:MOSFET-PCH-SOT23-6: P channel MOSFET in an SOT23-6
R1-R7 R9 R10 R12 R16 R17 R27 R36 = oresat-rcl:R-US_: RESISTOR, American symbol; DIS: Digi-Key; DPN: 1276-4275-1-ND; MFR: Samsung; MPN: RC1005F6653CS
R8 R11 R13 R18-R20 R24 = oresat-rcl:R-US_: RESISTOR, American symbol
TP1-TP10 TP12-TP23 = Tova:TEST-POINT
U1 = U-Maxim-MAX892LEUA+T-power-switch:MAX892LEUA+T: MAX891L / MAX892L Current-Limited, High-Side P-Channel Switch with Thermal Shutdown; MANUFACTURER_PART_NUMBER: MAX892LEUA+T; VENDOR: Maxim Integrated Products
U2 U3 = U-TI-TCAN330-CAN-transceiver:TCAN330; MFR: Texas Instruments; MPN: TCAN330GDCNT
U4 = U-TI-TPS2596XX-eFuse:TPS2596XX: TPS2596XX <http://www.ti.com/product/TPS2596> - eFuse With Accurate Current Monitor and Fast Overvoltage Protection Specifications Input voltage: 2.7-V to 19-V, (21-V Absolute maximum) Overvoltage Protection: Fast overvoltage clamp (3.8-V, 5.7-V and 13.8- V pin-selectable thresholds) with a response time of 5-μs (typical) Current Limiting: Adjustable, 0.125-A to 2-A Current Monitoring: Analog through pin ILIM Operating Temperature Range: –40 °C to +125 °C Body Size: SOIC (8) 4.91 mm x 3.9 mm
U5 = U-TI-TPS6211x-SPS-buck:TPS6211X: TPS6211x 17-V, 1.5-A, Synchronous Step-Down Converter; MFR: TI; MPN: TPS62111RSA
U6 = U-Maxim-MAX6374-watchdog:MAX6374KA-T; MANUFACTURER_PART_NUMBER: max6374kat; VENDOR: Maxim Integrated Products
U7 = U-ST-STM32F446RE-uC:STM32F446RE
U$1 = oresat-cards:ORESAT-CARD-V1.1
X1 = low-gain-radio:CRYSTAL-WITH-GND; DIS: Digi-Key; DPN: XC2181CT-ND; MFR: ECS Inc.; MPN: ECS-160-10-36Q-ES-TR

## Board
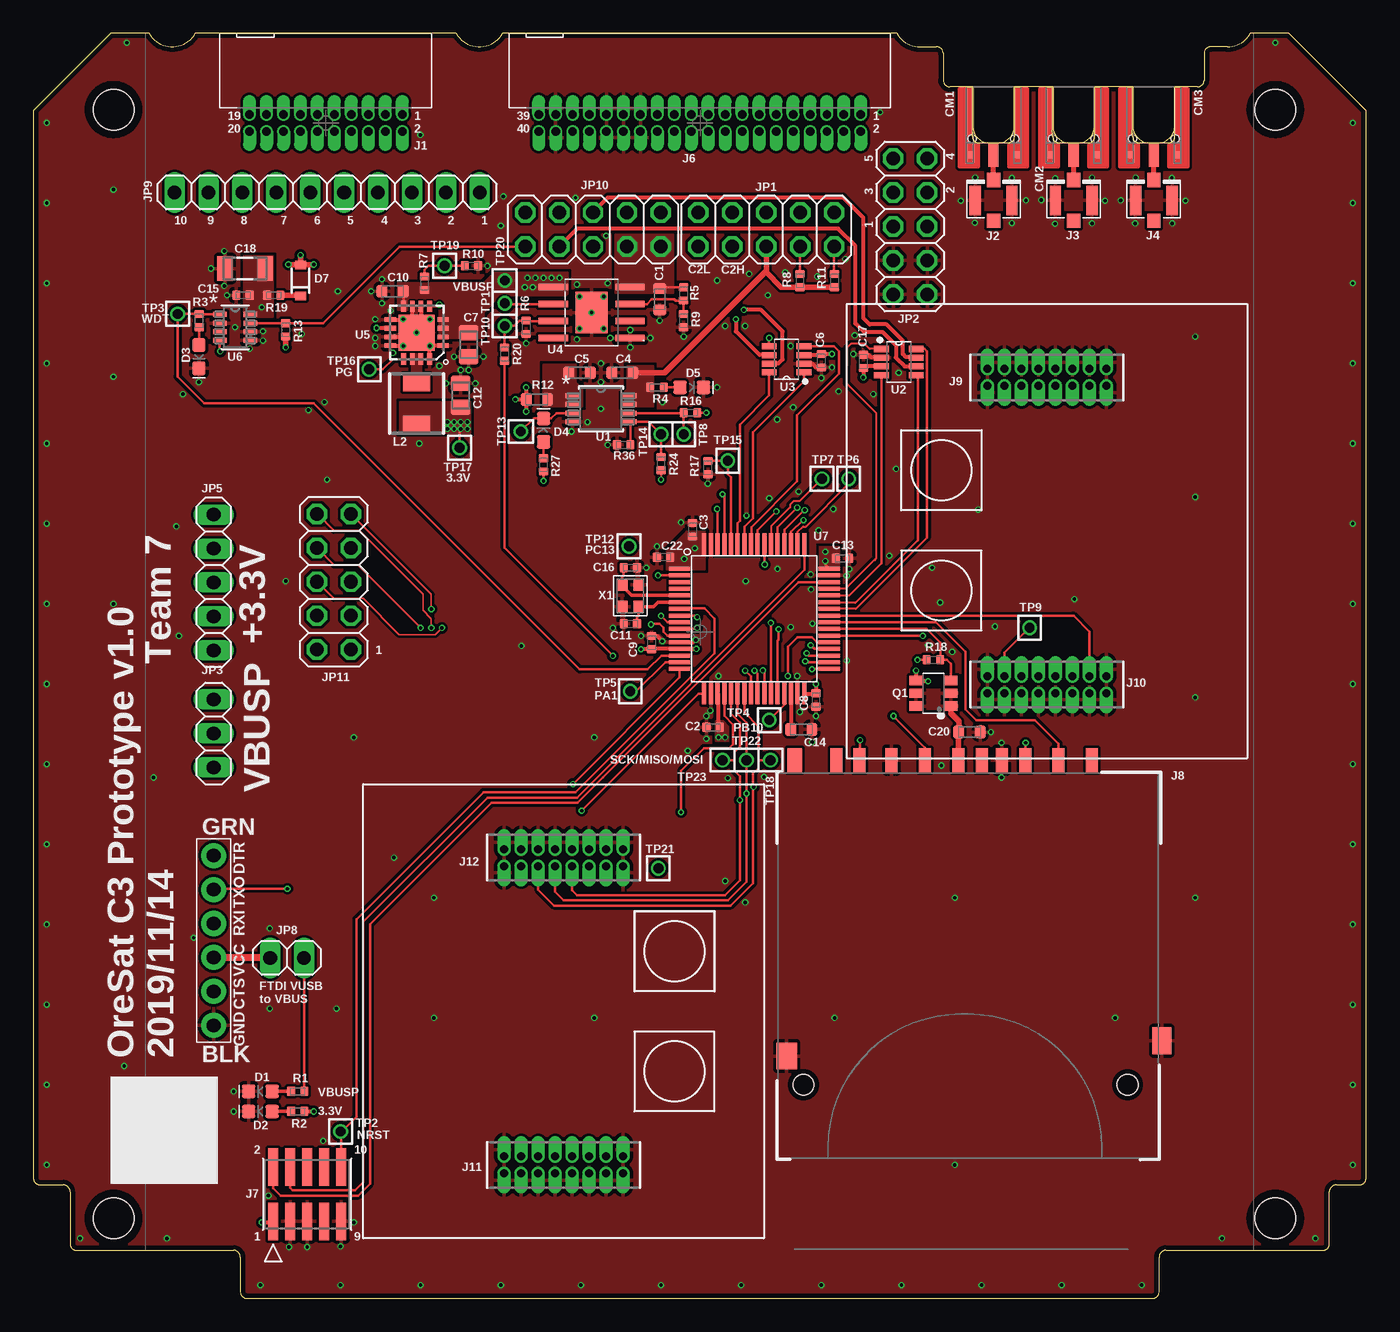
[diagram p4: board, top side]
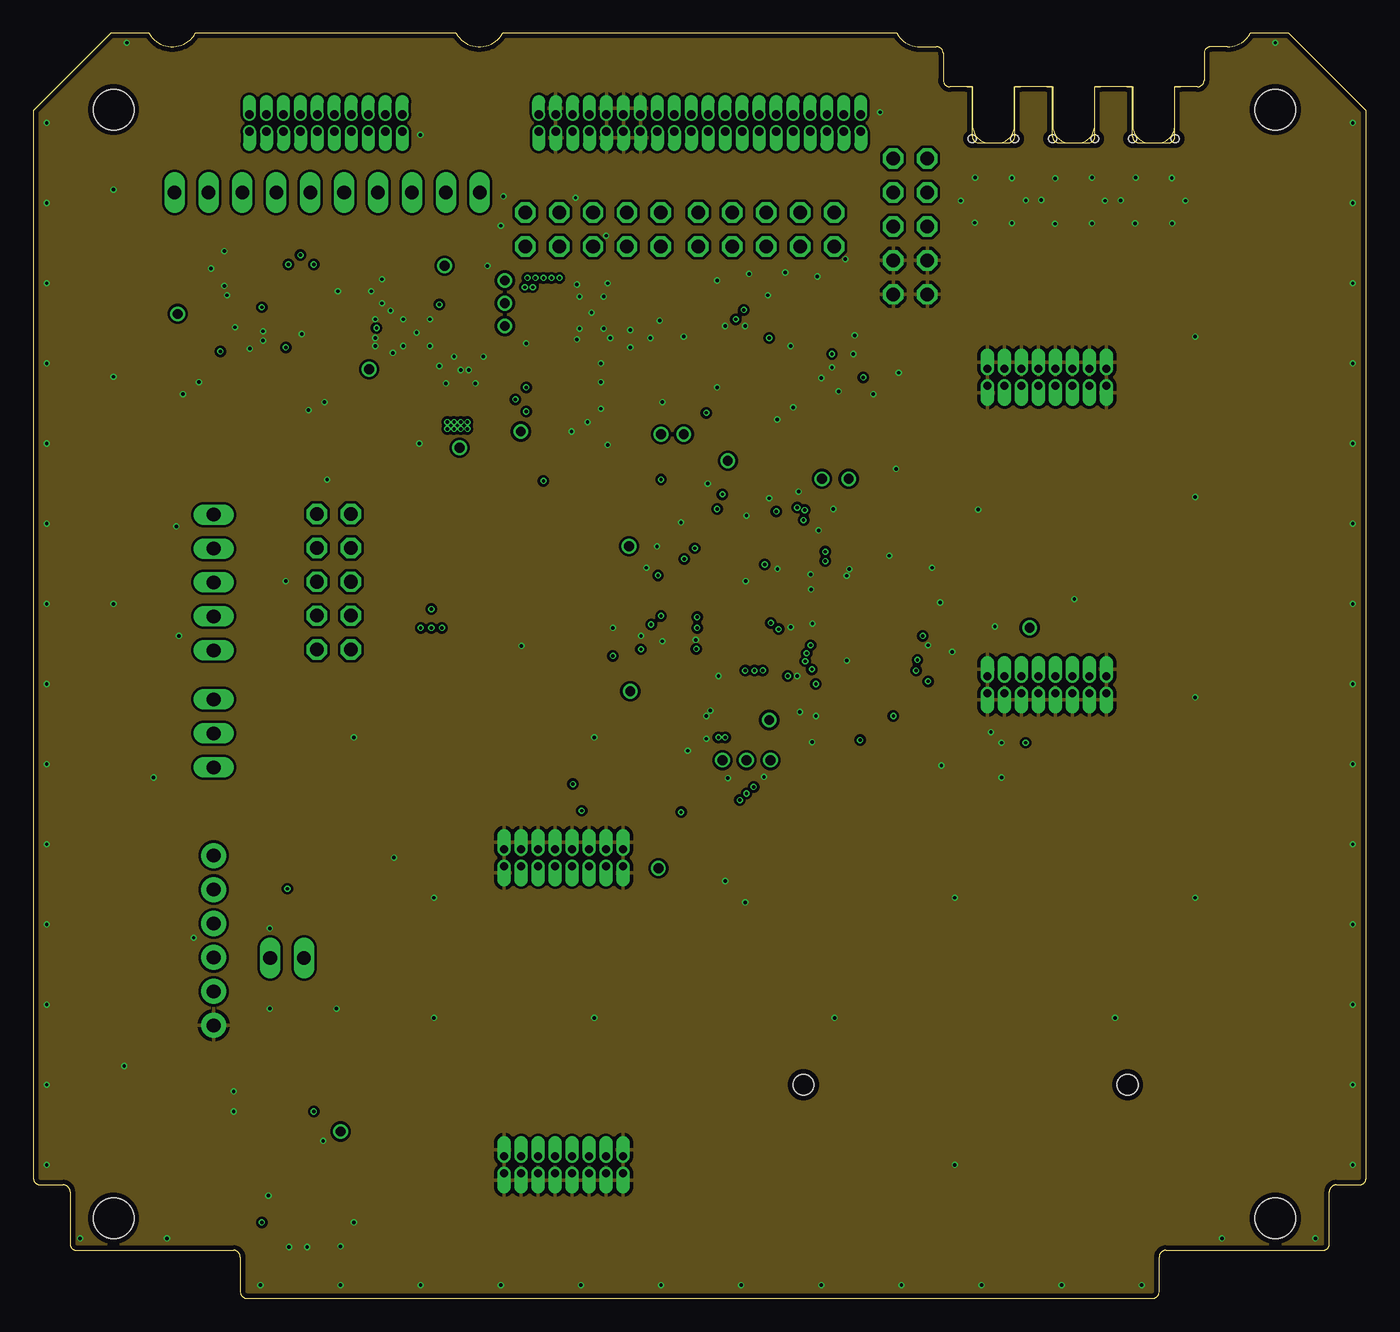
[diagram p5: board, inner layer Route2]
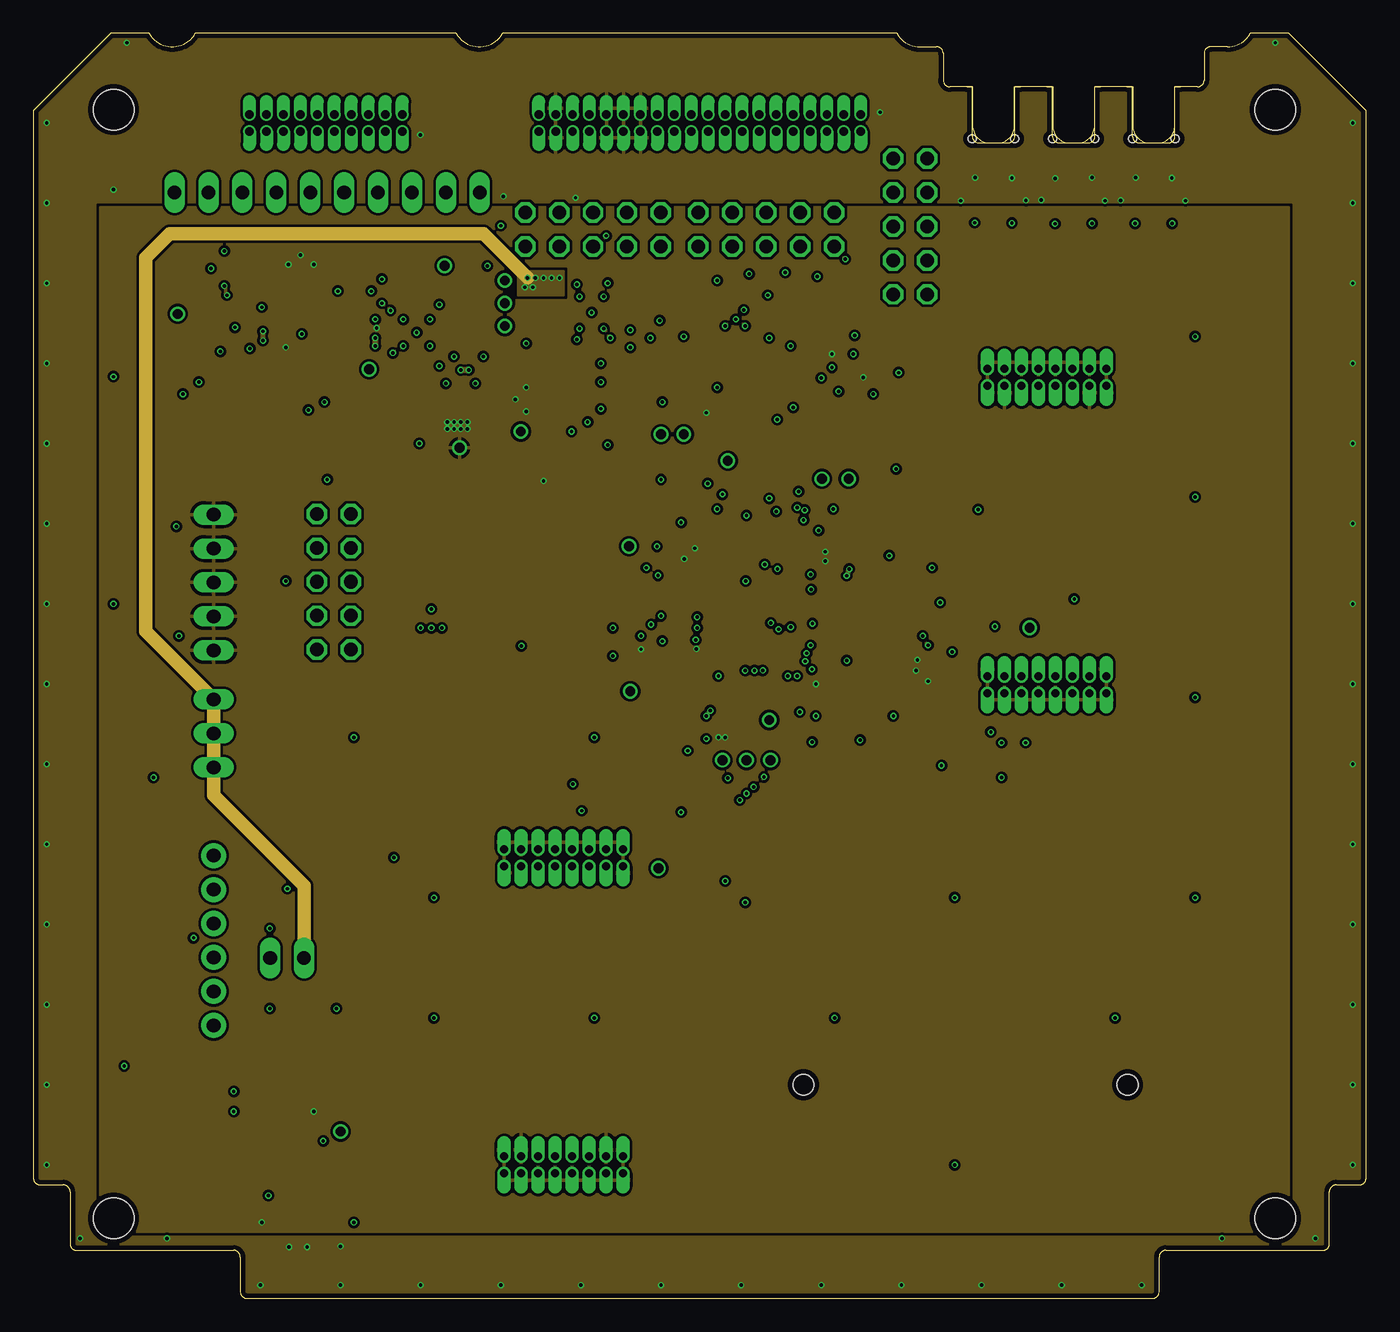
[diagram p6: board, inner layer route]
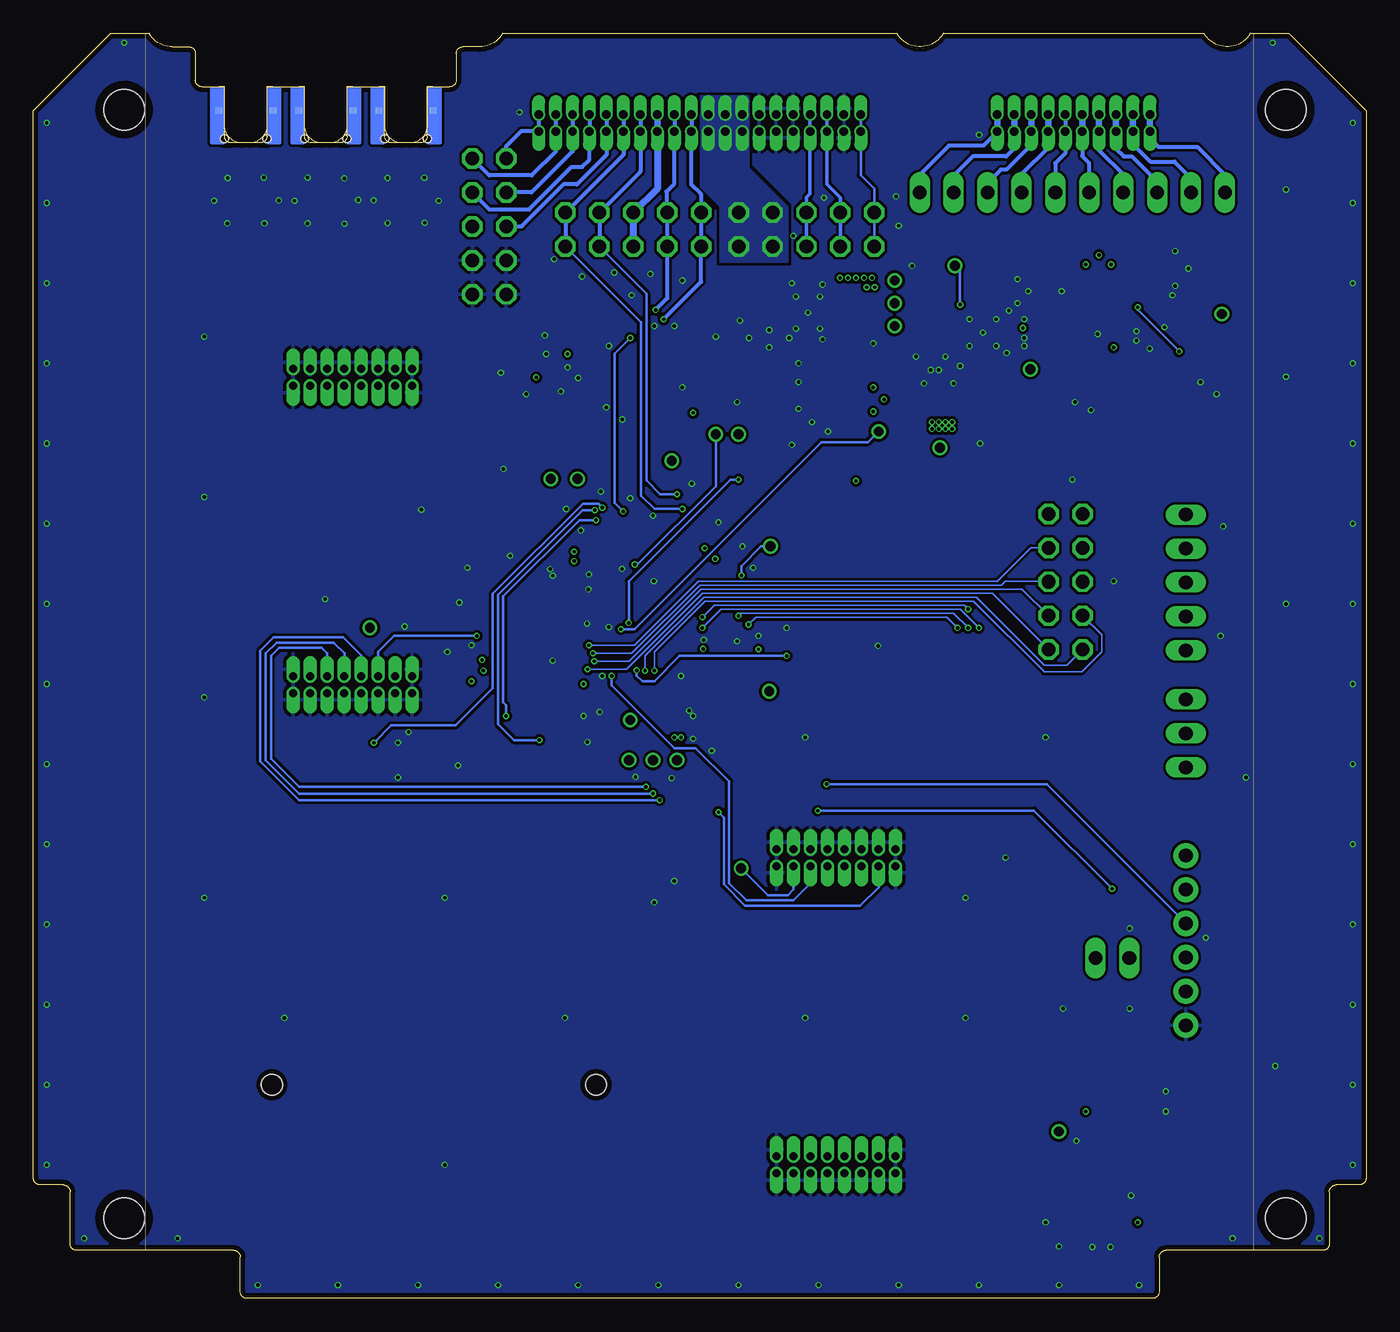
[diagram p7: board, bottom side, seen from below]

Size 99.8 x 94.7 mm. Coordinates in mm from the lower left corner, seen from the top.
Copper layers (1*2*15*16): Top 0.035559375mm / dielectric 0.17018125mm / Route2 0.01778125mm / dielectric 47mil / route 0.01778125mm / dielectric 0.17018125mm / Bottom 0.035559375mm
Design rules "oshpark4layer *": minimum track width 5mil, minimum drill 10mil, track to track 5mil, track to pad 5mil, pad to pad 5mil, via to via 5mil, smd to smd 5mil, copper to edge 15mil, drill to drill 6mil, minimum pad ring 4mil, minimum via ring 4mil, stop-mask expansion 2.5mil, vias tented up to drill 10mil, thermal gap 10mil

### Footprints (pad centres in the part's own frame; a part is rotated, then mirrored left to right if it is on the bottom)
.0603-B-NOSILK = smd 0.8 x 0.95: 1 -0.8,0; 2 0.8,0
.0402-B-NOSILK = smd 0.6 x 0.7: 1 -0.5,0; 2 0.5,0
.0805-B-NOSILK = smd 1.15 x 1.45: 1 -0.9,0; 2 0.9,0
1206-B = smd 1.15 x 1.8: 1 -1.5,0; 2 1.5,0
J-MOLEX-SMPM-073300-003X = smd 0.508 x 0.508: P$1 -1.778,-5.08; P$2 1.778,-5.08 | smd 0.508 x 0.508 bottom: P$3 -2.032,-1.778; P$4 2.032,-1.778 | smd 0.762 x 1.778: RF 0,-5.08 | hole 0.61: 1.587,-3.886; -1.587,-3.886
LED-0603 = smd 1 x 1: A -0.877,0; C 0.877,0
SOD-323 = smd 0.63 x 0.83: 1 -1.15,0; 2 1.15,0
STAND-OFF-TIGHT = hole 3.048: 0,0
J-SAMTEC-TFM-110-X1-XXX-D-RA = drill 0.635 pad 0.965 offset: 1 5.715,0.635; 2 5.715,-0.635; 3 4.445,0.635; 4 4.445,-0.635; 5 3.175,0.635; 6 3.175,-0.635; 7 1.905,0.635; 8 1.905,-0.635; 9 0.635,0.635; 10 0.635,-0.635; 11 -0.635,0.635; 12 -0.635,-0.635; 13 -1.905,0.635; 14 -1.905,-0.635; 15 -3.175,0.635; 16 -3.175,-0.635; 17 -4.445,0.635; 18 -4.445,-0.635; 19 -5.715,0.635; 20 -5.715,-0.635
U.FL = smd 2.2 x 0.85: 1 0,1.375; 2 0,-1.375 | smd 1.05 x 1: FEED 1.525,0; NC -1.525,0
6_PIN_SERIAL_TARGET_SIDE_W_SILK = drill 1.016 pad 1.88: P$1 -6.35,0; P$2 -3.81,0; P$3 -1.27,0; P$4 1.27,0; P$5 3.81,0; P$6 6.35,0
J-SAMTEC-TFM-120-X1-XXX-D-RA = drill 0.635 pad 0.965 offset: 1 12.065,0.635; 2 12.065,-0.635; 3 10.795,0.635; 4 10.795,-0.635; 5 9.525,0.635; 6 9.525,-0.635; 7 8.255,0.635; 8 8.255,-0.635; 9 6.985,0.635; 10 6.985,-0.635; 11 5.715,0.635; 12 5.715,-0.635; 13 4.445,0.635; 14 4.445,-0.635; 15 3.175,0.635; 16 3.175,-0.635; 17 1.905,0.635; 18 1.905,-0.635; 19 0.635,0.635; 20 0.635,-0.635; 21 -0.635,0.635; 22 -0.635,-0.635; 23 -1.905,0.635; 24 -1.905,-0.635; 25 -3.175,0.635; 26 -3.175,-0.635; 27 -4.445,0.635; 28 -4.445,-0.635; 29 -5.715,0.635; 30 -5.715,-0.635; 31 -6.985,0.635; 32 -6.985,-0.635; 33 -8.255,0.635; 34 -8.255,-0.635; 35 -9.525,0.635; 36 -9.525,-0.635; 37 -10.795,0.635; 38 -10.795,-0.635; 39 -12.065,0.635; 40 -12.065,-0.635
CON10_2X5_DUK_FTSH = smd 0.762 x 2.794: 1 -2.54,-2.032; 2 -2.54,2.032; 3 -1.27,-2.032; 4 -1.27,2.032; 5 0,-2.032; 6 0,2.032; 7 1.27,-2.032; 8 1.27,2.032; 9 2.54,-2.032; 10 2.54,2.032
SD = smd 1.8 x 0.9: 1 -1,6.77; 2 -1,4.27; 3 -1,2.52; 4 -1,-0.73; 5 -1,-3.23; 6 -1,-5.73; 7 -1,-8.15; 8 -1,-9.85; 9 -1,9.27; CD -1,1.02 | smd 2 x 1.4: SH@1 20,14.496 | smd 2 x 1.527: SH@2 21.15,-13.589 | smd 1.8 x 1.1: WP -1,-13 | hole 1.55: 23.3,11.94; 23.3,-12.32
2X8X1.27 = drill 0.6 pad 1.016 offset: 1 -4.445,0.635; 2 -4.445,-0.635; 3 -3.175,0.635; 4 -3.175,-0.635; 5 -1.905,0.635; 6 -1.905,-0.635; 7 -0.635,0.635; 8 -0.635,-0.635; 9 0.635,0.635; 10 0.635,-0.635; 11 1.905,0.635; 12 1.905,-0.635; 13 3.175,0.635; 14 3.175,-0.635; 15 4.445,0.635; 16 4.445,-0.635
2X05 = drill 1.016 octagon: 1 -5.08,-1.27; 2 -5.08,1.27; 3 -2.54,-1.27; 4 -2.54,1.27; 5 0,-1.27; 6 0,1.27; 7 2.54,-1.27; 8 2.54,1.27; 9 5.08,-1.27; 10 5.08,1.27
1X03 = drill 1.016 long: 1 -2.54,0; 2 0,0; 3 2.54,0
1X05 = drill 1.016 long: 1 -5.08,0; 2 -2.54,0; 3 0,0; 4 2.54,0; 5 5.08,0
1X02 = drill 1.016 long: 1 -1.27,0; 2 1.27,0
1X10 = drill 1.016 long: 1 -11.43,0; 2 -8.89,0; 3 -6.35,0; 4 -3.81,0; 5 -1.27,0; 6 1.27,0; 7 3.81,0; 8 6.35,0; 9 8.89,0; 10 11.43,0
ECS-MPI4040 = smd 2 x 1.3: 1 0,1.575; 2 0,-1.575
SOT23-6 = smd 0.7 x 1: 1 -0.95,-1.3; 2 0,-1.3; 3 0.95,-1.3; 4 0.95,1.3; 5 0,1.3; 6 -0.95,1.3
2MM-TEST-POINT = drill 0.737: 1 0,0
21-0036K-L = smd 1.06 x 0.376: 1 -2.134,0.975; 2 -2.134,0.325; 3 -2.134,-0.325; 4 -2.134,-0.975; 5 2.134,-0.975; 6 2.134,-0.325; 7 2.134,0.325; 8 2.134,0.975
SOT23-8_TI-DCN = smd 0.45 x 1.1: 1 -0.975,-1.3; 2 -0.325,-1.3; 3 0.325,-1.3; 4 0.975,-1.3; 5 0.975,1.3; 6 0.325,1.3; 7 -0.325,1.3; 8 -0.975,1.3
SO-POWERPAD-8 = smd 0.5 x 2.2: 1 -1.905,-2.875; 2 -0.635,-2.875; 3 0.635,-2.875; 4 1.905,-2.875; 5 1.905,2.875; 6 0.635,2.875; 7 -0.635,2.875; 8 -1.905,2.875 | smd 3.1 x 2.4: THERMAL 0,0
S-PVQFN-16 = smd 0.85 x 0.35: 1 -1.975,0.975; 2 -1.975,0.325; 3 -1.975,-0.325; 4 -1.975,-0.975; 9 1.975,-0.975; 10 1.975,-0.325; 11 1.975,0.325; 12 1.975,0.975 | smd 0.35 x 0.85: 5 -0.975,-1.975; 6 -0.325,-1.975; 7 0.325,-1.975; 8 0.975,-1.975; 13 0.975,1.975; 14 0.325,1.975; 15 -0.325,1.975; 16 -0.975,1.975 | smd 2.7 x 2.7: PAD 0,0
21-0078H-L = smd 1.016 x 0.381: 1 -1.143,0.975; 2 -1.143,0.325; 3 -1.143,-0.325; 4 -1.143,-0.975; 5 1.143,-0.975; 6 1.143,-0.325; 7 1.143,0.325; 8 1.143,0.975
QFP-10X10-64 = smd 1.6 x 0.3: 1 -5.6,3.75; 2 -5.6,3.25; 3 -5.6,2.75; 4 -5.6,2.25; 5 -5.6,1.75; 6 -5.6,1.25; 7 -5.6,0.75; 8 -5.6,0.25; 9 -5.6,-0.25; 10 -5.6,-0.75; 11 -5.6,-1.25; 12 -5.6,-1.75; 13 -5.6,-2.25; 14 -5.6,-2.75; 15 -5.6,-3.25; 16 -5.6,-3.75; 33 5.6,-3.75; 34 5.6,-3.25; 35 5.6,-2.75; 36 5.6,-2.25; 37 5.6,-1.75; 38 5.6,-1.25; 39 5.6,-0.75; 40 5.6,-0.25; 41 5.6,0.25; 42 5.6,0.75; 43 5.6,1.25; 44 5.6,1.75; 45 5.6,2.25; 46 5.6,2.75; 47 5.6,3.25; 48 5.6,3.75 | smd 0.3 x 1.6: 17 -3.75,-5.6; 18 -3.25,-5.6; 19 -2.75,-5.6; 20 -2.25,-5.6; 21 -1.75,-5.6; 22 -1.25,-5.6; 23 -0.75,-5.6; 24 -0.25,-5.6; 25 0.25,-5.6; 26 0.75,-5.6; 27 1.25,-5.6; 28 1.75,-5.6; 29 2.25,-5.6; 30 2.75,-5.6; 31 3.25,-5.6; 32 3.75,-5.6; 49 3.75,5.6; 50 3.25,5.6; 51 2.75,5.6; 52 2.25,5.6; 53 1.75,5.6; 54 1.25,5.6; 55 0.75,5.6; 56 0.25,5.6; 57 -0.25,5.6; 58 -0.75,5.6; 59 -1.25,5.6; 60 -1.75,5.6; 61 -2.25,5.6; 62 -2.75,5.6; 63 -3.25,5.6; 64 -3.75,5.6
CRYSTAL_2.5X2 = smd 0.9 x 0.8: 1 -0.825,-0.625; 2 0.825,-0.625; 3 0.825,0.625; 4 -0.825,0.625

### Placement (x,y rotation side)
C1  46.9,74.8 270 top
C2  50.9,42.75 0 top
C3  49.37,57.55 270 top
C4  44.1,69.3 180 top
C5  40.9,69.3 0 top
C6  59,70.2 90 top
C7  32.6,71.4 270 top
C8  58.6,44.8 90 top
C9  46.3,49.1 270 top
C10  26.9,75.4 180 top
C11  44.7,50.5 180 top
C12  32,67.6 90 top
C13  60.6,55.4 180 top
C14  57.5,42.6 0 top
C15  15.7,75.1 180 top
C16  44.7,54.7 0 top
C17  62.15,70.14 270 top
C18  15.85,77.1 180 top
C20  70.1,42.4 0 top
C22  47.2,55.5 0 top
CM1  71.9,90.7 0 top
CM2  77.9,90.7 0 top
CM3  83.9,90.7 0 top
D1  17,15.5 180 top
D2  17,14 180 top
D3  12.4,70.5 270 top
D4  38.2,65 90 top
D5  49.3,68.2 0 top
D7  20,76.2 90 top
H1  93,6 0 top
H2  93,89 0 top
H3  6,89 0 top
H4  6,6 0 top
J1  21.9,87.99 0 top
J2  71.9,82.2 90 top
J3  77.9,82.2 90 top
J4  83.9,82.2 90 top
J5  13.5,26.8 270 top
J6  49.9,87.99 0 top
J7  20.5,7.8 0 top
J8  70,39.3 270 top
J9  75.9,68.95 180 top
J10  75.9,45.95 0 top
J11  39.7,10 0 top
J12  39.7,33 180 top
JP1  54.88,80.01 180 top
JP2  65.66,80.25 270 top
JP3  13.5,42.3 90 top
JP5  13.5,53.6 270 top
JP8  19,25.5 180 top
JP9  22,82.8 180 top
JP10  41.91,80.01 180 top
JP11  22.5,53.65 90 top
L2  28.7,67 0 top
Q1  67.4,45.3 90 top
R1  19.8,15.5 0 top
R2  19.8,14 0 top
R3  12.4,73.2 90 top
R4  46.7,68.2 180 top
R5  48.7,75.2 89.8 top
R6  36.9,72.7 90 top
R7  29.3,76 270 top
R8  57.4,76.2 90 top
R9  48.7,73.2 90 top
R10  32.8,77.3 180 top
R11  60,76.2 90 top
R12  37.7,67.3 180 top
R13  18.9,72.5 90 top
R16  49.2,66.3 0 top
R17  50.5,62.2 90 top
R18  67.4,47.8 0 top
R19  18,75.1 0 top
R20  35.3,70.7 270 top
R24  47,62.5 270 top
R27  38.2,62.4 270 top
R36  44.2,63.9 0 top
TP1  35.3,74.5 90 top
TP2  23,12.5 0 top
TP3  10.8,73.7 0 top
TP4  55.1,43.3 0 top
TP5  44.7,45.45 0 top
TP6  61.05,61.35 0 top
TP7  59.05,61.35 0 top
TP8  48.7,64.7 0 top
TP9  74.6,50.2 0 top
TP10  35.3,72.8 90 top
TP12  44.6,56.3 0 top
TP13  36.5,64.9 90 top
TP14  47,64.7 0 top
TP15  52,62.7 180 top
TP16  25.15,69.55 180 top
TP17  31.91,63.68 180 top
TP18  55.2,40.3 90 top
TP19  30.8,77.3 180 top
TP20  35.3,76.2 90 top
TP21  46.8,32.2 0 top
TP22  53.4,40.3 90 top
TP23  51.6,40.3 90 top
U1  42.5,66.6 0 top
U2  64.8,70.1 270 top
U3  56.4,70.3 90 top
U4  41.8,73.8 90 top
U5  28.7,72.3 180 top
U6  15.11,72.69 0 top
U7  53.98,50.88 0 top
U$1  0,0 0 top
X1  44.7,52.6 270 top

### Tracks (layer width: path | path; a pad name or v marks a point on that pad's centre or on a via)
3.3V  (via drill 0.25)
  Top 0.152: U7.19 51.25,45.26 | 51.25,42.9 C2.2
  Top 0.2: R18.1 v66.2,47.8 | 46.33,48.62 C9.2 | U7.48 59.3,54.91 v59.3,55.2 | v50.4,66.3 R16.2 | TP17.1 31.91,65.01 v32,65.1 | R27.2 v38.2,61.2
  Top 0.3: R2.2 v21,14 | 51.25,45.26 51.25,42.9 | v49.65,48.62 U7.13 46.33,48.62 45.52,48.62 v45.5,48.6 | U7.32 58.58,45.27 C8.2 v58.6,46 | v66.1,47 Q1.4 66.15,46.2 v67,46.2 | R12.2 v36.9,66.4 | v36.1,67.3 R12.2 | v36.9,68.2 R12.2 | v17.1,5.7 17.89,5.7 J7.1
  Top 0.305: U2.3 62.28,69.78 C17.2 v62.15,68.95 | U3.3 58.92,70.62 C6.2 v59.8,70.7 | U5.10 25.73,72.62 v25.7,72.65
  Top 0.4: v20,78.1 D7.2 20.05,77.4 | v21,77.4 20.05,77.4 | v19.1,77.4 20.05,77.4 | v18.9,71.2 R13.1
  other vias: 48.74,55.36 49.54,56.16 51.3,42 51.8,42 32.5,65.1 32.5,65.6 59.3,55.9 32,65.6 31.5,65.6 31.5,65.1 31,65.1 31,65.6
  pour Top (no thermals): 27.45,67.1 32.7,67.1 32.7,64.8 27.45,64.8
  pour route (isolate 0.2, rank 3): 5,81.7 94,81.7 94,5 5,5
  pour Top (isolate 0.15, no thermals): 50.3,57.4 48.9,57.4 47.4,55.9 47.4,54.6 50.3,54.6
  pour Top (no thermals): 60.35,56.25 58.85,56.25 58.85,54.55 60.35,54.55
  pour Top (isolate 0.2, no thermals): 51.1,43.2 51.1,41.75 52.1,41.75 52.1,43.2
!CB_FLT
  Top 0.2: U4.6 35.37,74.44 TP1.1
!OPD_ENABLE  (via drill 0.25)
  Top 0.2: v55.8,50.1 55.8,49.3 55.73,49.23 U7.28 | U1.3 39.17,66.28 38.78,65.88 D4.C 37.48,65.88 TP13.1
  Bottom 0.2: TP13.1 37.3,64.1 40.8,64.1 54.8,50.1 v55.8,50.1
!SD
  Top 0.2: JP10.10 27.44,78.74 21.7,73 R13.2 18.89,73.02 U6.7
  Bottom 0.2: J6.39 J6.40 37.84,84.06 36.83,83.06 JP10.9 JP10.10
AUX-1
  Bottom 0.3: J1.2 27.61,87.33 28.65,86.3 31.25,86.3 33.45,84.1 33.45,83.32 JP9.1
  Bottom 0.5: J1.2 J1.1
AUX-2
  Bottom 0.3: J1.4 26.34,86.11 26.95,85.5 29.45,85.5 30.95,84 30.89,83.94 JP9.2
  Bottom 0.5: J1.4 J1.3
AUX-3
  Bottom 0.3: J1.6 25.07,86.38 26.95,84.5 27.35,84.5 28.35,83.5 JP9.3
  Bottom 0.5: J1.6 J1.5
AUX-4
  Bottom 0.3: J1.8 23.8,86.14 25.81,84.14 JP9.4
  Bottom 0.5: J1.8 J1.7
AUX-5
  Bottom 0.3: JP9.5 23.27,84.98 22.54,85.72 J1.10 J1.9
AUX-6
  Bottom 0.3: J1.12 21.27,85.52 20.75,85 20.75,83.32 JP9.6
  Bottom 0.5: J1.12 J1.11
AUX-7
  Bottom 0.3: J1.14 20,85.94 18.19,84.14 JP9.7
  Bottom 0.5: J1.14 J1.13
AUX-8
  Bottom 0.3: J1.16 18.73,86.08 18.15,85.5 17.55,85.5 15.65,83.6 JP9.8
  Bottom 0.5: J1.16 J1.15
AUX-9
  Bottom 0.3: J1.18 17.45,86.41 16.15,85.1 14.35,85.1 13.11,83.86 JP9.9
  Bottom 0.5: J1.18 J1.17
AUX_!SHUTDOWN
  Bottom 0.3: J1.20 16.18,86.83 15.55,86.2 12.65,86.2 10.55,84.1 10.57,84.08 JP9.10
  Bottom 0.5: J1.20 J1.19
BOOT0
  Top 0.203: R17.2 TP15.1 52,61.7 52.23,61.47 U7.60
CAN1_H
  Top 0.152: U2.7 66.14,70.47
  Top 0.2: JP10.5 41.91,81.31
  Top 0.3: 66.14,70.47 65.34,70.47 65.1,70.71 65.1,71.7 63.88,72.92 62.62,72.92 62.13,73.41 62.13,80.92 60.63,82.42 43.02,82.42 41.91,81.31
  Bottom 0.25: J6.33 J6.34 41.65,82.69 41.9,82.43 JP10.5 JP10.6
CAN1_L
  Top 0.3: JP10.8 40.72,80.08 60.26,80.08 61.55,78.78 61.55,73 62.22,72.34 63.62,72.34 64.59,71.37 64.59,70.44 65.25,69.78 U2.6
  Bottom 0.25: J6.35 J6.36 40.38,83.41 39.37,82.4 JP10.7 JP10.8
CAN1_RX
  Top 0.152: 63.5,55.03 61.12,52.66 59.62,52.66 U7.44
  Top 0.2: 63.5,55.03 U2.4
CAN1_SHDN
  Top 0.152: 66.25,56.77 61.55,52.07 60.25,52.07 | 60.25,52.07 59.75,52.07 59.7,52.12 U7.43 60.2,52.12 60.25,52.07 | U2.5 66.25,68.98
  Top 0.2: 66.25,68.98 66.25,56.77
CAN1_SILENT
  Top 0.152: 66.9,56.94 61.58,51.62 60.1,51.62 60.09,51.62 U7.42
  Top 0.2: 66.9,56.94 66.9,70.9 66.72,71.08 U2.8
CAN1_TX
  Top 0.152: U7.45 60.81,53.13 62.91,55.23 62.93,55.23 63.1,55.4 63.1,66.3 60.9,68.5 60.91,71.16 61.23,71.47 62.22,71.47 62.62,71.08 U2.1
CAN2_H  (via drill 0.25)
  Top 0.305: U3.7 55.77,69.97 56.1,70.3 56.1,72.4 54.5,74 v53.2,74
  Bottom 0.3: J6.17 J6.18 51.84,87.33 51.84,83.41 | JP1.7 JP1.8 52.34,74.87 52.34,74.86
  Bottom 0.305: 51.84,83.41 52.39,82.85 52.39,81.33 JP1.7 | 52.34,74.86 v53.2,74
CAN2_L  (via drill 0.25)
  Top 0.152: U3.6
  Top 0.305: U3.6 54.37,70.63 52.6,72.4 v52.6,73.3
  Bottom 0.3: J6.19 J6.20 50.55,87.35 50.55,83.42
  Bottom 0.305: v52.6,73.3 49.8,76.1 JP1.10 JP1.9 49.82,81.3 49.82,82.69 50.55,83.42
CAN2_RX
  Top 0.152: 57.71,71.28 U3.4 | U7.57 53.76,56.5
  Top 0.2: 53.76,56.5 53.76,57.73 57.2,61.17 57.2,66.1 60.32,69.23 60.32,70.92 59.96,71.28 57.71,71.28
CAN2_SHDN  (via drill 0.25)
  Top 0.2: U3.5 v55.1,71.9 | U7.56 54.23,57.52 v55.63,58.91
  Bottom 0.152: 56.28,70.72 v55.1,71.9
  Bottom 0.2: 56.28,70.72 56.28,59.56 v55.63,58.91
CAN2_SILENT
  Top 0.2: U3.8 55.1,67.6 52.9,65.4 52.9,58.2 52.73,58.03 U7.59
CAN2_TX
  Top 0.152: U7.58 53.26,56.5
  Top 0.2: U3.1 57.7,68.66 53.9,64.86 53.9,58.4 53.26,57.75 53.26,56.5
CB_IOUT
  Top 0.2: U4.7 36.94,73.17 R6.2 36.4,73.2 36,72.8 TP10.1 R20.1
CB_IOUT_IN  (via drill 0.25)
  Top 0.2: U7.26 54.73,46.87 54.6,47 v54.62,47.02 | v43.4,48.1 35.3,56.2 R20.2
  Bottom 0.2: v54.62,47.02 54.62,46.62 54.2,46.2 53.3,46.2 51.4,48.1 v43.4,48.1
CRYSTALIN
  Top 0.2: C16.1 44.2,54.1 44.08,53.98 X1.1
  Top 0.254: X1.1 44.08,53.34 44.79,52.62 U7.5
CRYSTALOUT
  Top 0.2: C11.1 45.2,51 45.33,51.12 X1.3
  Top 0.254: X1.3 46.42,51.77 46.77,52.12 U7.6
EN/UVLO
  Top 0.2: R9.2 R5.1 48.1,74.7 48,74.8 46.3,74.8 45.94,74.44 U4.3
GND  (via drill 0.25)
  Top 0.3: U2.2 62.77,70.42 62.55,70.64 C17.1 | 29.02,72.62 U5.PAD 28.38,72.62 | U7.12 49.42,49.12 v49.6,49.3 | C9.1 46.7,49.6 v47.1,49.2 | U3.2 58.33,69.97 58.6,69.7 C6.1
  Top 0.305: U5.7 28.38,72.62 | U5.6 29.02,72.62 | U5.1 29.68,71.33 | U5.16 29.68,71.33 | 29.68,71.33 U5.PAD | U5.12 26.75,71.3 28,71.3 28.7,72 U5.PAD | U5.11 28.38,71.97 U5.PAD | U5.9 27.73,73.28 U5.PAD
  other vias: 3.5,4.5 64.8,69.3 1,16 1,22 1,28 1,34 1,40 1,46 1,58 1,52 1,64 1,70 1,76 1,82 1,88 7,94 96,4.5 10,4.5 17,1 23,1 29,1 41,1 47,1 53,1 59,1 65,1 71,1 77,1 17.7,27.7 25.6,71.3 25.6,71.9 25.3,75.4 25.6,73.3 26.92,70.78 26.75,73.95 31.5,70.5 30.4,69.8 32.6,69.5 33.7,70.5 40.6,82.4 35.2,82.5 42.89,79.55 63.4,88.8 35,1 83,1 93,94 28.98,87.1 20.5,3.85 15,14 15,15.5 59,68.9 86.28,82.17 85.28,80.47 85.25,83.88 82.55,83.9 81.42,82.2 82.5,80.47 80.25,82.17 79.28,83.9 79.28,80.47 76.5,80.45 75.47,82.22 76.53,83.85 73.28,83.88 74.33,82.2 73.28,80.5 70.5,80.53 69.45,82.17 70.53,83.9 51.8,72.8 1,10 98.8,16 98.8,22 98.8,28 98.8,34 98.8,40 98.8,46 98.8,58 98.8,52 98.8,64 98.8,70 98.8,76 98.8,82 98.8,88 98.8,10 55.7,65.8 23,3.9 19.14,3.85 47.1,67.1 56.3,76.8 61.5,72.1 56.7,71.3 40.7,71.8 48.7,72 36.9,71.5 20.1,72.2 26.1,76.3 46.2,71.9 44.7,71.2 44.7,72.5 43.2,71.9 40.7,75.9 43,76 51.3,46.6 56.71,50.25 60.91,47.75 55.72,54.62 53.34,53.7 60.9,54.1 58.24,53.08 58.34,50.52 50.5,61 46.7,56.3 43.4,50.2 61.4,70.7 67.3,54.7 70.75,59.05 77.95,52.35 67.9,52.1 36.55,48.85 28.9,64 10.7,57.8 22,61.3 12.4,68.6 49,41 45.9,54.7 45.5,49.6 58.6,43.6 57.4,43.9 57.2,46.6 58.2,54.2 50.4,43.6 50.4,41.9 59.8,69.7 48.5,58.1 72.5,41.6 72.5,39 40.9,72.6 40.9,75 42.7,75 42.7,72.6 41.8,73.8 51.2,76.2 53.6,76.7 55,75.1 34,77.3 26.1,74.5 32,69.5 33.1,68.5 30.9,68.5 13.3,77.1 14.3,78.4 14.3,75.8 14.5,75.1 15.1,72.7 17.2,72.4 17.2,71.7 16.2,71.1 71.7,42.4 50.7,44 61.1,54.6 11.2,67.7 24,5.7 42.5,70 42.5,68.6 42.5,66.6 41.5,65.6 40.3,64.9 43,63.9 46.9,73.2 28.7,72.3 29.7,73.3 27.7,73.3 27.7,71.3 29.7,71.3 62.9,67.7 60.3,67.9 55.1,59.9 56.9,66.7 51.2,68.2 60.8,77.8 58.7,76.5 35,80.3 22.8,75.4 20.6,66.5 21.8,67.1 10.9,49.6 18.9,53.7 24,42 27,33 30,30 30,21 42,21 60,21 81,21 69,30 87,60 87,72 87,45 87,30 42,42 9,39 12,27 53.3,72.8 53.4,58.6 59.9,59.1 58.8,57.5 64.1,55.6 64.6,62.1 57.3,60.4 68,39.9 67,48.9 68.8,48.4 72,50.3 58.31,41.65 54.71,39.05 52.01,38.95 51.81,31.25 53.31,29.65 89,4.5 6,83 6,69 6,52 17.7,21.7 22.7,21.7 21.7,11.8 17.6,7.7 6.8,17.4 69,10
  pour Top (isolate 0.2, rank 6): 0.1,0 99.8,0 99.8,94.6 0.1,94.6
  pour Bottom (isolate 0.2, rank 6): 0,0 99.8,0 99.8,94.7 0,94.7
  pour Route2 (isolate 0.2): 0.1,94.7 99.8,94.7 99.8,-0.1 0,-0.1 0,94.6
  pour route (isolate 0.2, rank 6): 0,0 0,95 100,95 100,0
MMC_CS
  Top 0.2: J8.1 76.77,41.53 75,43.3 70.6,43.3 69.8,44.1 69.8,48.4 67.58,50.62 U7.40
MMC_PWR
  Top 0.2: U7.39 66.88,50.12 67.92,49.08 67.92,47.83 R18.2 68.4,47.8 68.7,47.5 Q1.3
MMC_VDD
  Top 0.4: J8.4 69.27,42.37 C20.1 69.3,43.2 68.7,43.8 Q1.1
  pour Top: 65.7,45.6 69.2,45.6 69.2,44.1 65.7,44.1
N$1
  Top 0.2: D3.A R3.1
N$3
  Top 0.4: R19.2 19.95,75.1 D7.1
N$5
  Top 0.2: R27.1 D4.A
N$270
  Top 0.25: R1.1 D1.A
N$271
  Top 0.25: R2.1 D2.A
N$300
  Top 0.38: J4.FEED CM3.RF
N$400
  Top 0.2: R4.1 D5.A
N$406
  Top 0.508: J5.P$4 17.7,25.53 JP8.2
NRST
  Top 0.152: U7.7 48.41,51.65
  Top 0.2: 48.41,51.65 50.25,51.65 51,50.9 51,48.3 40.6,37.9 33.7,37.9 24.2,28.4 24.2,13.6 23.04,12.44 J7.10 23.04,12.46 TP2.1
OPD-3.3V
  pour Top (isolate 0.2, no thermals): 41.1,66.8 41.1,68.1 40.6,68.6 40.6,69.9 38.2,69.9 38.2,66.8
OPD_!FAULT  (via drill 0.25)
  Top 0.152: v54.77,54.95 54.75,54.95 | 54.75,56.46 U7.55
  Top 0.2: 54.75,54.95 54.75,56.46 | U1.6 48.67,66.28 R16.1 TP8.1
  Bottom 0.2: v54.77,54.95 54.55,54.95 48.7,60.79 TP8.1
OPD_ISET
  Top 0.2: R24.1 TP14.1 46.08,65.62 U1.5 44.7,65.61 R36.2
OPD_ISET_IN  (via drill 0.25)
  Top 0.152: 55.23,45.28 U7.27 | R24.2 v47,61.3
  Top 0.2: v55.23,50.58 55.23,45.28
  Bottom 0.152: 55.2,50.6 v55.23,50.58
  Bottom 0.2: 55.2,50.6 55.2,53.7 47.6,61.3 v47,61.3
OPD_PWR
  Top 0.4: R11.1 R8.1 56,75.7 54.88,76.82 | 54.88,76.82 54.83,76.87 47.26,69.3 C4.1 | 54.88,76.82 JP1.6
  Bottom 0.5: J6.15 J6.16
  Bottom 0.508: J6.16 53.08,83.08 JP1.5 JP1.6
  pour Top (isolate 0.2, no thermals): 44.1,66.8 46.4,66.8 46.4,69.8 44.5,69.8 44.5,68.1 44.1,67.7
OPD_SCL  (via drill 0.25)
  Top 0.2: U7.61 51.73,60.06 v51.6,60.2 | R8.2 57.4,78.72 JP1.4
  Bottom 0.2: v51.6,60.2 52.86,60.2 53.9,61.24 53.9,75.19 57.42,78.72 JP1.4
  Bottom 0.3: J6.13 J6.14
  Bottom 0.305: J6.14 54.34,84.36 JP1.3 JP1.4
OPD_SDA  (via drill 0.25)
  Top 0.152: U7.62 51.23,56.51 51.24,56.51
  Top 0.2: 51.24,56.51 51.24,59.06 v51.2,59.1 | R11.2 59.96,76.74 JP1.2
  Bottom 0.2: v51.2,59.1 53.29,59.1 54.29,60.1 54.29,73.07 JP1.2
  Bottom 0.3: J6.11 J6.12
  Bottom 0.305: J6.12 55.62,85.62 JP1.1 JP1.2
PA1
  Top 0.2: TP5.1 45.15,45.45 47.32,47.62 U7.15
PA15
  Top 0.152: TP6.1 61.05,60.99 57.84,57.78 57.63,57.78 57.23,57.38 U7.50
PB10
  Top 0.152: U7.29 56.23,44.44 TP4.1
PB12  (via drill 0.25)
  Top 0.2: U7.33 58.33,47.12 v58.3,47.1
  Bottom 0.127: v58.3,47.1 55.4,47.1 49.7,52.8 28,52.8 JP11.1
PC0  (via drill 0.25)
  Top 0.127: v29.8,51.6 29.8,52.7 JP11.9
  Top 0.2: U7.8 49.58,51.12 v49.7,51
  Bottom 0.127: v49.7,51 48.8,51.9 30.1,51.9 v29.8,51.6
PC1  (via drill 0.25)
  Top 0.127: v29.8,50.2 29.8,50.9 29.2,51.5 29.2,52.7 24.4,57.5 22.5,57.5 21.27,58.73 JP11.10
  Top 0.2: U7.9 47.48,50.62 v47,51.1
  Bottom 0.127: v47,51.1 46.8,51.3 30.9,51.3 v29.8,50.2
PC2  (via drill 0.25)
  Top 0.127: v29,50.2 24.3,54.9 22.52,54.9 JP11.8
  Top 0.2: U7.10 49.62,50.12 v49.7,50.2
  Bottom 0.127: v49.7,50.2 48.3,51.6 30.39,51.6 v29,50.21 v29,50.2
PC3  (via drill 0.25)
  Top 0.127: v30.6,50.2 30.1,49.7 27.4,49.7 24.7,52.4 22.5,52.4 21.25,53.65 JP11.6
  Top 0.2: U7.11 47.48,49.62 47.2,49.9 47.2,50.2 46.9,50.5 46.3,50.5 v46.25,50.45
  Bottom 0.127: v46.25,50.45 45.71,51 31.4,51 v30.6,50.2
PC4  (via drill 0.25)
  Top 0.2: U7.24 53.73,46.56 v53.3,47
  Bottom 0.127: v53.3,47 53.3,48.4 49.5,52.2 29.4,52.2 24.1,46.9 21.3,46.9 19.8,48.4 19.8,49.68 JP11.4
PC5  (via drill 0.25)
  Top 0.2: U7.25 54.23,46.77 v54,47
  Bottom 0.127: v54,47 54,48.1 49.6,52.5 29.2,52.5 24.1,47.4 22.4,47.4 JP11.2
PC13  (via drill 0.25)
  Top 0.2: U7.2 v46.77,54.12
  Bottom 0.2: TP12.1 45.3,56.3 46.77,54.83 v46.77,54.12
PD2
  Top 0.152: TP7.1 57.38,59.68 56.92,59.68 56.67,59.43 56.67,59.23 55.23,57.79 U7.54
RADIO1_CS  (via drill 0.25)
  Top 0.2: U7.37 58.67,49.12 58.3,49.5 57.2,49.5 56.5,48.8 v56.5,46.6
  Bottom 0.2: J12.5 41.6,31.1 42.9,29.8 46.4,29.8 47.7,31.1 47.7,38.7 50.2,41.2 51.8,41.2 56.5,45.9 v56.5,46.6
RADIO1_IRQ  (via drill 0.25)
  Top 0.2: U7.20 51.73,43.62 52.4,42.96 52.4,41.5 52.1,41.2 50.2,41.2 48.5,39.5 v48.5,36.4
  Bottom 0.2: v48.5,36.4 48.1,36 48.1,31 46.5,29.4 37.9,29.4 36.5,30.8 36.5,32.34 J12.13
RADIO1_SYSCLK
  Bottom 0.2: J12.3 42.88,30.62 43.3,30.2 44.8,30.2 TP21.1
RADIO2_CS  (via drill 0.25)
  Top 0.2: U7.38 66.58,49.62 v66.6,49.6
  Bottom 0.2: v66.6,49.6 72.8,49.6 74,48.4 J10.5
RADIO2_IRQ
  Top 0.2: J10.13 79.08,49.92 77.9,51.1 77.88,51.12 U7.41
RADIO2_SYSCLK
  Top 0.2: TP9.1 72.72,48.33 J10.3
RF1
  Top 0.38: J2.FEED CM1.RF
RF2
  Top 0.38: J3.FEED CM2.RF
SPARE1
  Bottom 0.3: J6.9 J6.10 | 63.25,80.25 63.2,80.3
  Bottom 0.305: J6.10 56.88,85.61 59.1,83.4 60.1,83.4 63.2,80.3 | JP2.5 63.25,80.25
SPARE2
  Bottom 0.3: J6.7 J6.8
  Bottom 0.305: JP2.4 65.66,81.52 62.68,81.52 59.5,84.7 58.7,84.7 58.16,85.25 J6.8
SPARE3
  Bottom 0.3: J6.5 J6.6
  Bottom 0.305: J6.6 59.42,85.86 62.5,82.79 JP2.3
SPARE4
  Bottom 0.3: J6.3 J6.4
  Bottom 0.305: J6.4 60.7,85.86 62.48,84.07 65.67,84.07 JP2.2
SPARE5
  Bottom 0.3: J6.1 J6.2
  Bottom 0.305: J6.2 63.28,87.36 64.39,86.25 JP2.1
SPI1_MISO  (via drill 0.25)
  Top 0.2: U7.22 52.73,43.77 53.4,43.1 TP22.1 v53.4,37.8 53.4,31.2 52,29.8 39.7,29.8 39.06,30.43 J12.9
  Bottom 0.152: 76.5,46.62 J10.9
  Bottom 0.2: v53.4,37.8 79.9,37.8 82.4,40.3 82.4,48.3 81.6,49.1 77.3,49.1 76.5,48.3 76.5,46.62
SPI1_MOSI  (via drill 0.25)
  Top 0.152: 53.9,38.3 v53.93,38.3
  Top 0.2: U7.23 53.23,43.87 54.3,42.8 54.3,40.3 | 54.3,40.3 54.3,39.7 53.9,39.3 53.9,38.3 53.9,31.1 52.2,29.4 39,29.4 37.8,30.61 J12.11 | TP18.1 54.3,40.3
  Bottom 0.152: J10.11
  Bottom 0.2: v53.93,38.3 79.9,38.3 82,40.4 82,48.1 81.4,48.7 78.2,48.7 77.8,48.3 J10.11
SPI1_SCK  (via drill 0.25)
  Top 0.2: U7.21 52.23,43.77 52.9,43.11 52.9,41.3 52.5,40.9 52.5,40.3 | 52.5,40.3 52.5,39.5 52.9,39.1 v52.9,37.3 52.9,31.3 51.8,30.2 40.7,30.2 40.34,30.57 J12.7 | TP23.1 52.5,40.3
  Bottom 0.2: v52.9,37.3 79.9,37.3 82.8,40.2 82.8,48.5 81.8,49.5 76.6,49.5 75.27,48.16 J10.7
SPI2_MISO  (via drill 0.25)
  Top 0.2: U7.35 58.08,48.12 v57.9,48.3
  Bottom 0.127: v57.9,48.3 55,48.3 49.9,53.4 27.3,53.4 27,53.7 23.82,53.7 JP11.5
SPI2_MOSI  (via drill 0.25)
  Top 0.2: U7.36 58.48,48.62 v58.2,48.9
  Bottom 0.127: v58.2,48.9 54.8,48.9 50,53.7 27.6,53.7 25.1,56.2 JP11.7
SPI2_SCK  (via drill 0.25)
  Top 0.2: U7.34 57.88,47.62 v57.8,47.7
  Bottom 0.127: v57.8,47.7 55.2,47.7 49.8,53.1 30.2,53.1 30.1,53.1 25.76,53.1 JP11.3
SPI3_MISO  (via drill 0.25)
  Top 0.2: U7.52 56.23,57.53 57.71,59.01 v57.76,59.01 | v61.9,41.8 61.9,40.35 J8.7
  Bottom 0.2: v57.76,59.01 58.66,59.01 65,52.67 65,43 63.8,41.8 v61.9,41.8
SPI3_MOSI  (via drill 0.25)
  Top 0.152: v57.2,59.2 v57.19,59.2
  Top 0.2: U7.53 55.73,57.74 v57.19,59.2 | v74.3,41.6 74.3,40.33 J8.2
  Bottom 0.152: v57.2,59.21 v57.2,59.2
  Bottom 0.2: v57.2,59.21 57.48,59.49 58.65,59.49 65.4,52.74 65.4,45.7 68.2,42.9 73,42.9 v74.3,41.6
SPI3_SCK  (via drill 0.25)
  Top 0.152: 57.62,58.27 v57.67,58.27
  Top 0.2: U7.51 56.73,57.38 57.62,58.27 | v64.4,43.6 66.77,41.23 J8.5
  Bottom 0.2: v57.67,58.27 58.9,58.27 64.62,52.55 64.62,44.62 64.4,44.4 v64.4,43.6
SWCLK
  Top 0.2: U7.49 57.73,54.53 40.7,37.5 34,37.5 24.7,28.2 24.7,8.7 24.1,8.1 19.4,8.1 19.23,8.27 J7.4
SWDIO
  Top 0.2: U7.46 57.29,53.62 42.66,39 40.76,37.1 34.3,37.1 25.2,28 25.2,8.6 24.3,7.7 18.5,7.7 17.96,8.24 J7.2
TPS62111-PG
  Top 0.2: U5.13 26.93,70.33 26.15,69.55 TP16.1
TPS62111-SYNC  (via drill 0.25)
  Top 0.2: v30.4,74.4 30.27,74.28 U5.5 | R7.1 29.3,77 29.6,77.3 TP19.1 R10.2
  Bottom 0.2: v30.4,74.4 30.4,76.9 TP19.1
TPS62111_SW
  pour Top (no thermals): 29,70.6 28.4,70.6 28.4,68.4 29,68.4
USART2_RX  (via drill 0.25)
  Top 0.2: U7.17 49.83,45.27 v41.06,36.51 | v19.02,30.67 13.56,30.67 J5.P$2
  Bottom 0.2: v19.02,30.67 24.86,36.51 v41.06,36.51
USART2_TX  (via drill 0.25)
  Top 0.2: v40.4,38.5 48.38,46.48 U7.16
  Bottom 0.2: v40.4,38.5 23.91,38.5 13.5,28.09 J5.P$3
VBUS
  Top 0.2: R5.2 47,75.7 C1.1
  pour Top (isolate 0.2, no thermals): 43.6,79.63 43.6,75.27 47.9,75.27 47.9,79.63
  pour Bottom (no thermals): 46.2,89.98 47.99,89.98 49.85,90 49.85,83.21 48.4,81.76 48.4,77.6 43.3,77.6 43.3,81.7 46.2,84.6
VBUSP  (via drill 0.25)
  Top 0.152: C10.1 27.83,75.4
  Top 0.2: JP8.1 20.27,15.53 | U5.4 U5.3 | U5.8 27.73,75.3 27.83,75.4
  Top 0.203: 20.27,15.53 R1.2
  route 1: JP8.1 20.27,30.89 13.5,37.66 JP3.1 JP3.2 JP3.3 8.4,49.94 8.4,77.9 10.2,79.7 33.7,79.7 v37,76.4
  other vias: 37.4,75.7 39.4,76.4 38.8,76.4 38.2,76.4 37.6,76.4 36.8,75.7
  pour Top (no thermals): 33.7,71.9 33.7,73.8 35,75.1 39.9,75.1 40,75.2 40,76.8 34.5,76.8 33.7,76 27.3,76 27.3,74 30.4,74 30.4,71.9
  pour route (isolate 0.2, no thermals): 36.3,76.9 39.7,76.9 39.7,75.1 36.3,75.1
VCAP
  Top 0.3: U7.30 56.73,42.63
  Top 0.4: 56.73,42.63 C14.1
WDT
  Top 0.2: U7.14 47.02,48.12 46,47.1 40.9,47.1 21,67 12.8,67 10.8,69 TP3.1 R3.2 12.44,73.67 U6.1
WDT-PWR  (via drill 0.25)
  Top 0.2: U6.4 13.97,71.03 14,71 v14,70.9
  Bottom 0.2: v14,70.9 17.1,74 v17.1,74.2
  pour Top (isolate 0.2, no thermals): 15.8,73.5 17.9,73.5 17.9,78 15.8,78

### Text on the board
tPlace: 5 | 4 | 3 | 2 | 10 | 9 | 8 | 7 | 6 | 5 | 4 | 3 | 2 | 1 | 1 | C2L | C2H | VBUSP | WDT | PG | 3.3V | PC13 | +3.3V | Team 7 | 1 | PA1 | PB10 | SCK/MISO/MOSI | VBUSP | FTDI VUSB / to VBUS | OreSat C3 Prototype v1.0 | 2019/11/14 | VBUSP | 3.3V | NRST